# EasyEDA schematic 1-Schematic_miniCoffee.json

## Sheets
1 LEDs: TITLE: LEDs; REV: 1.0; Date: 2019-11-27; Sheet: 1/1; Drawn By: Jacopo Franco; Company: Addictivers.cc
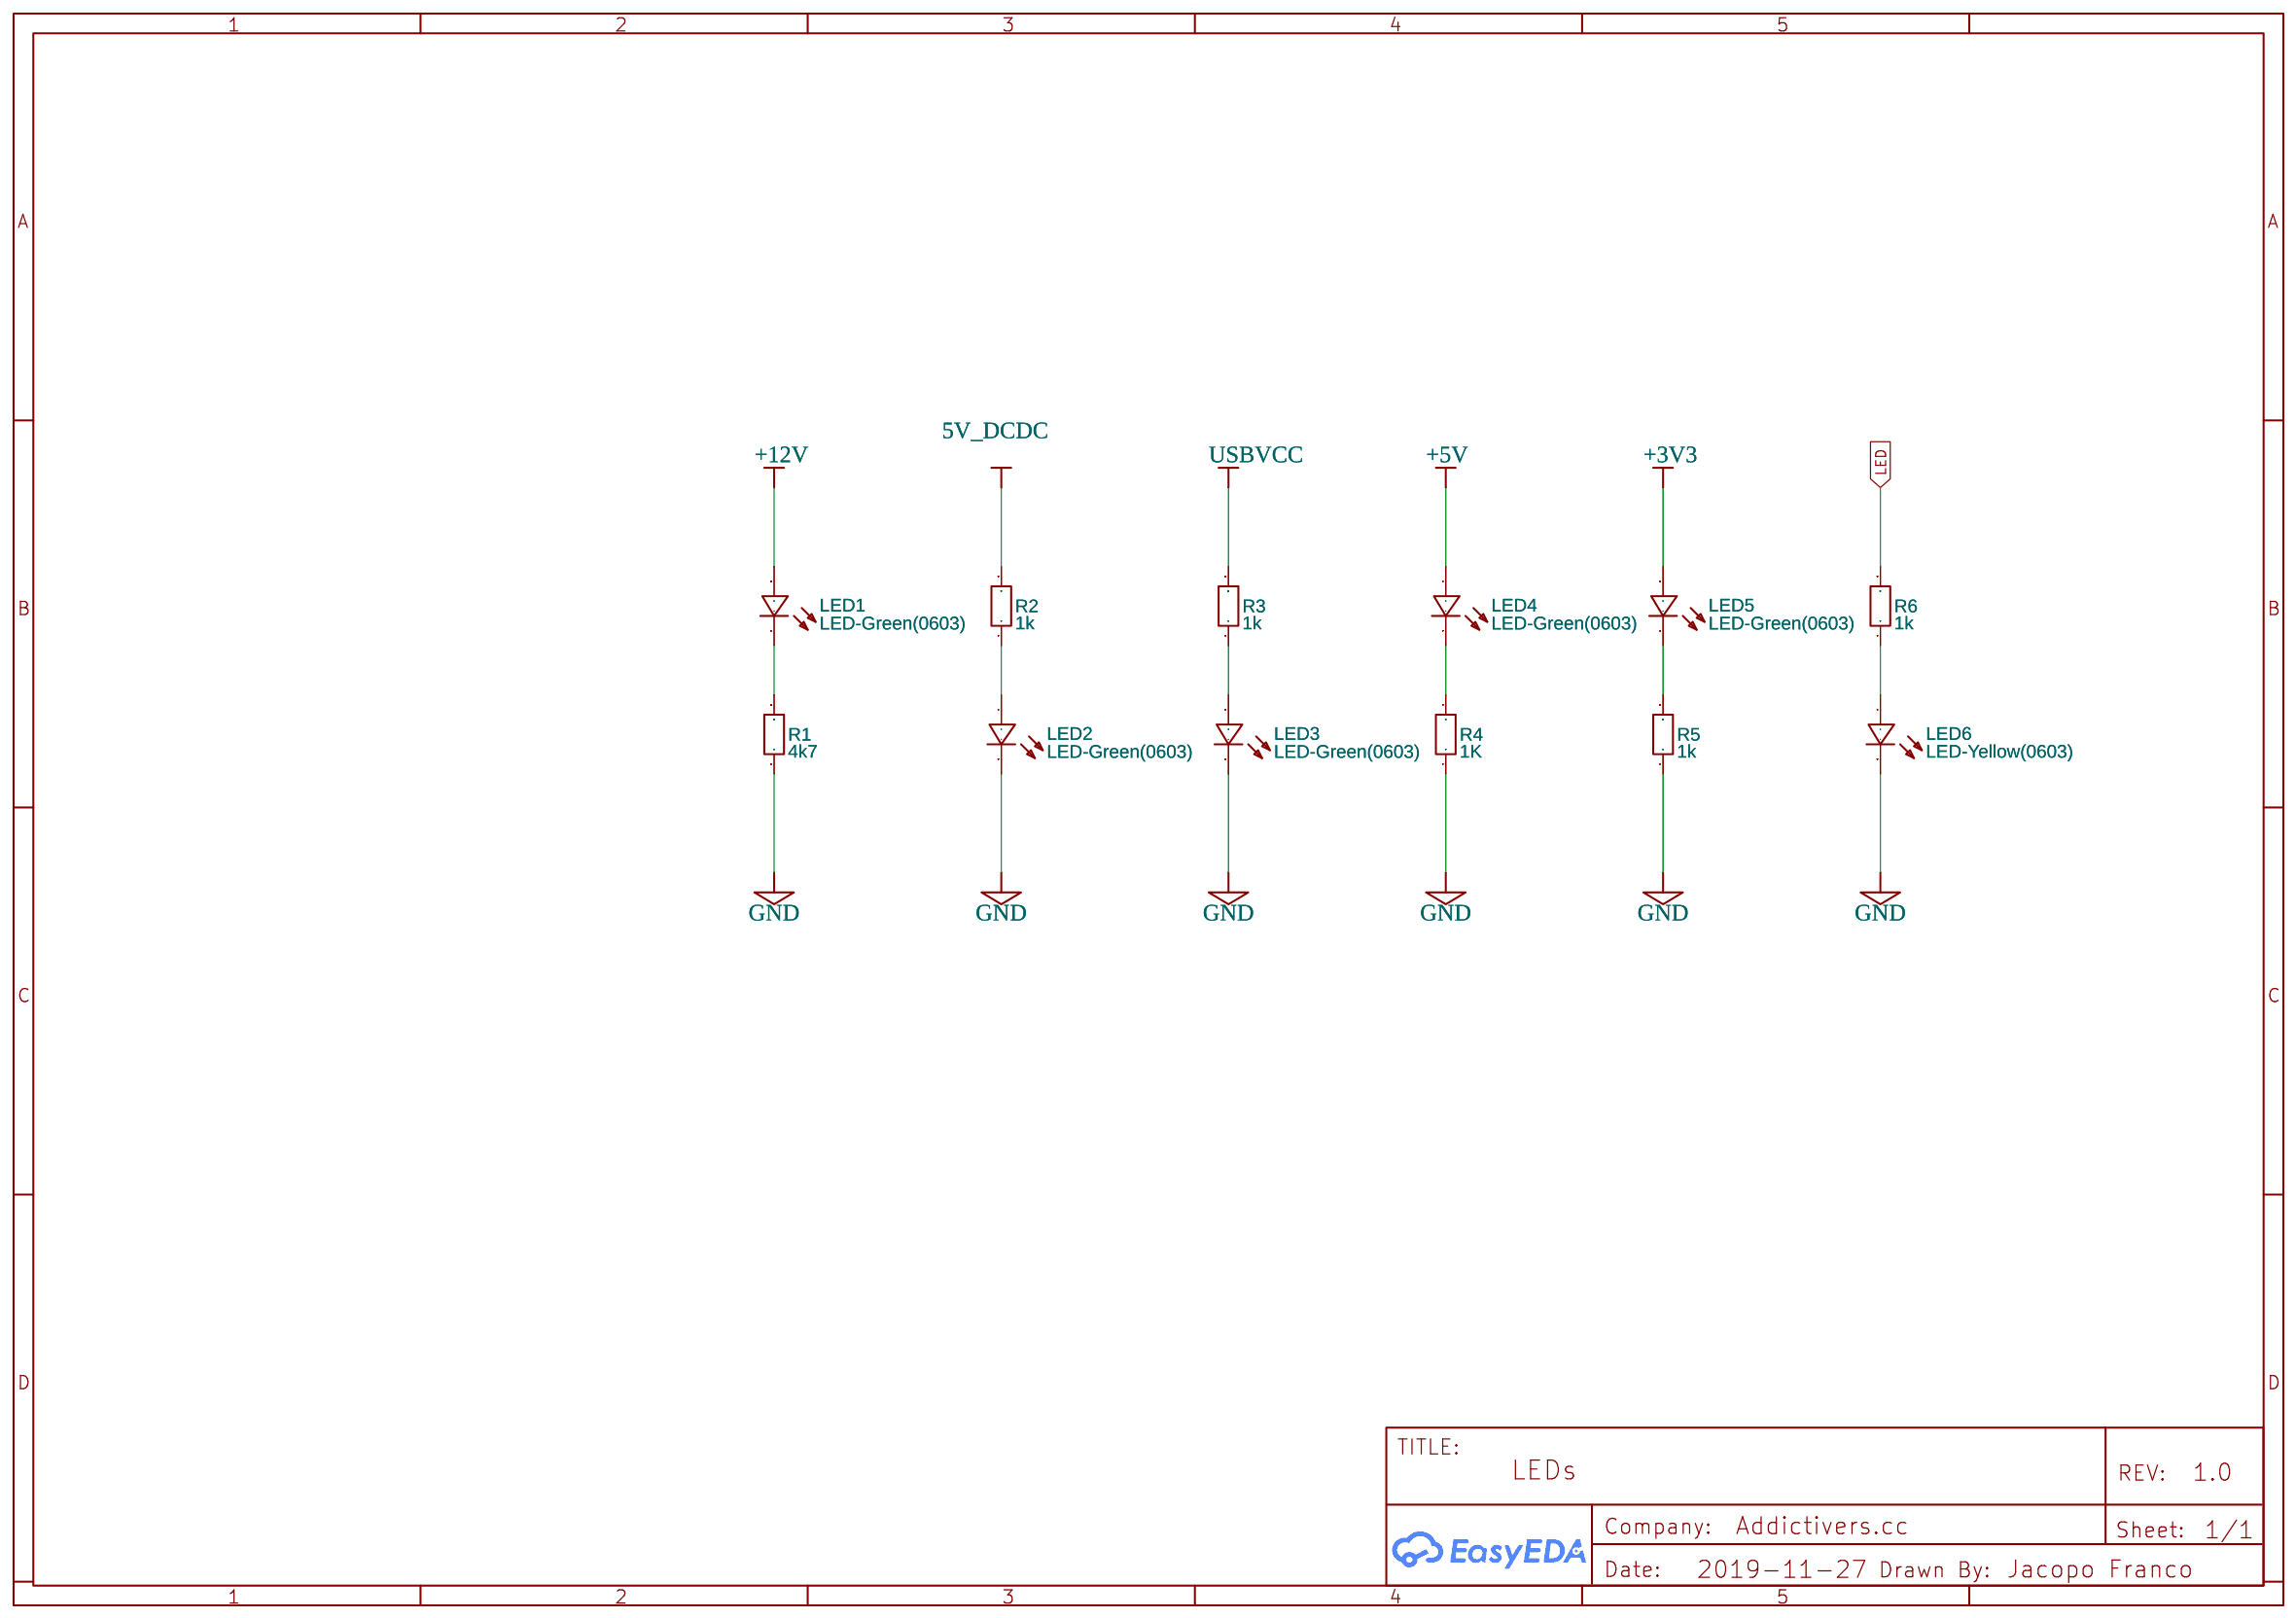
[diagram p0: LEDs]
2 Microcontroller: TITLE: Microcontroller
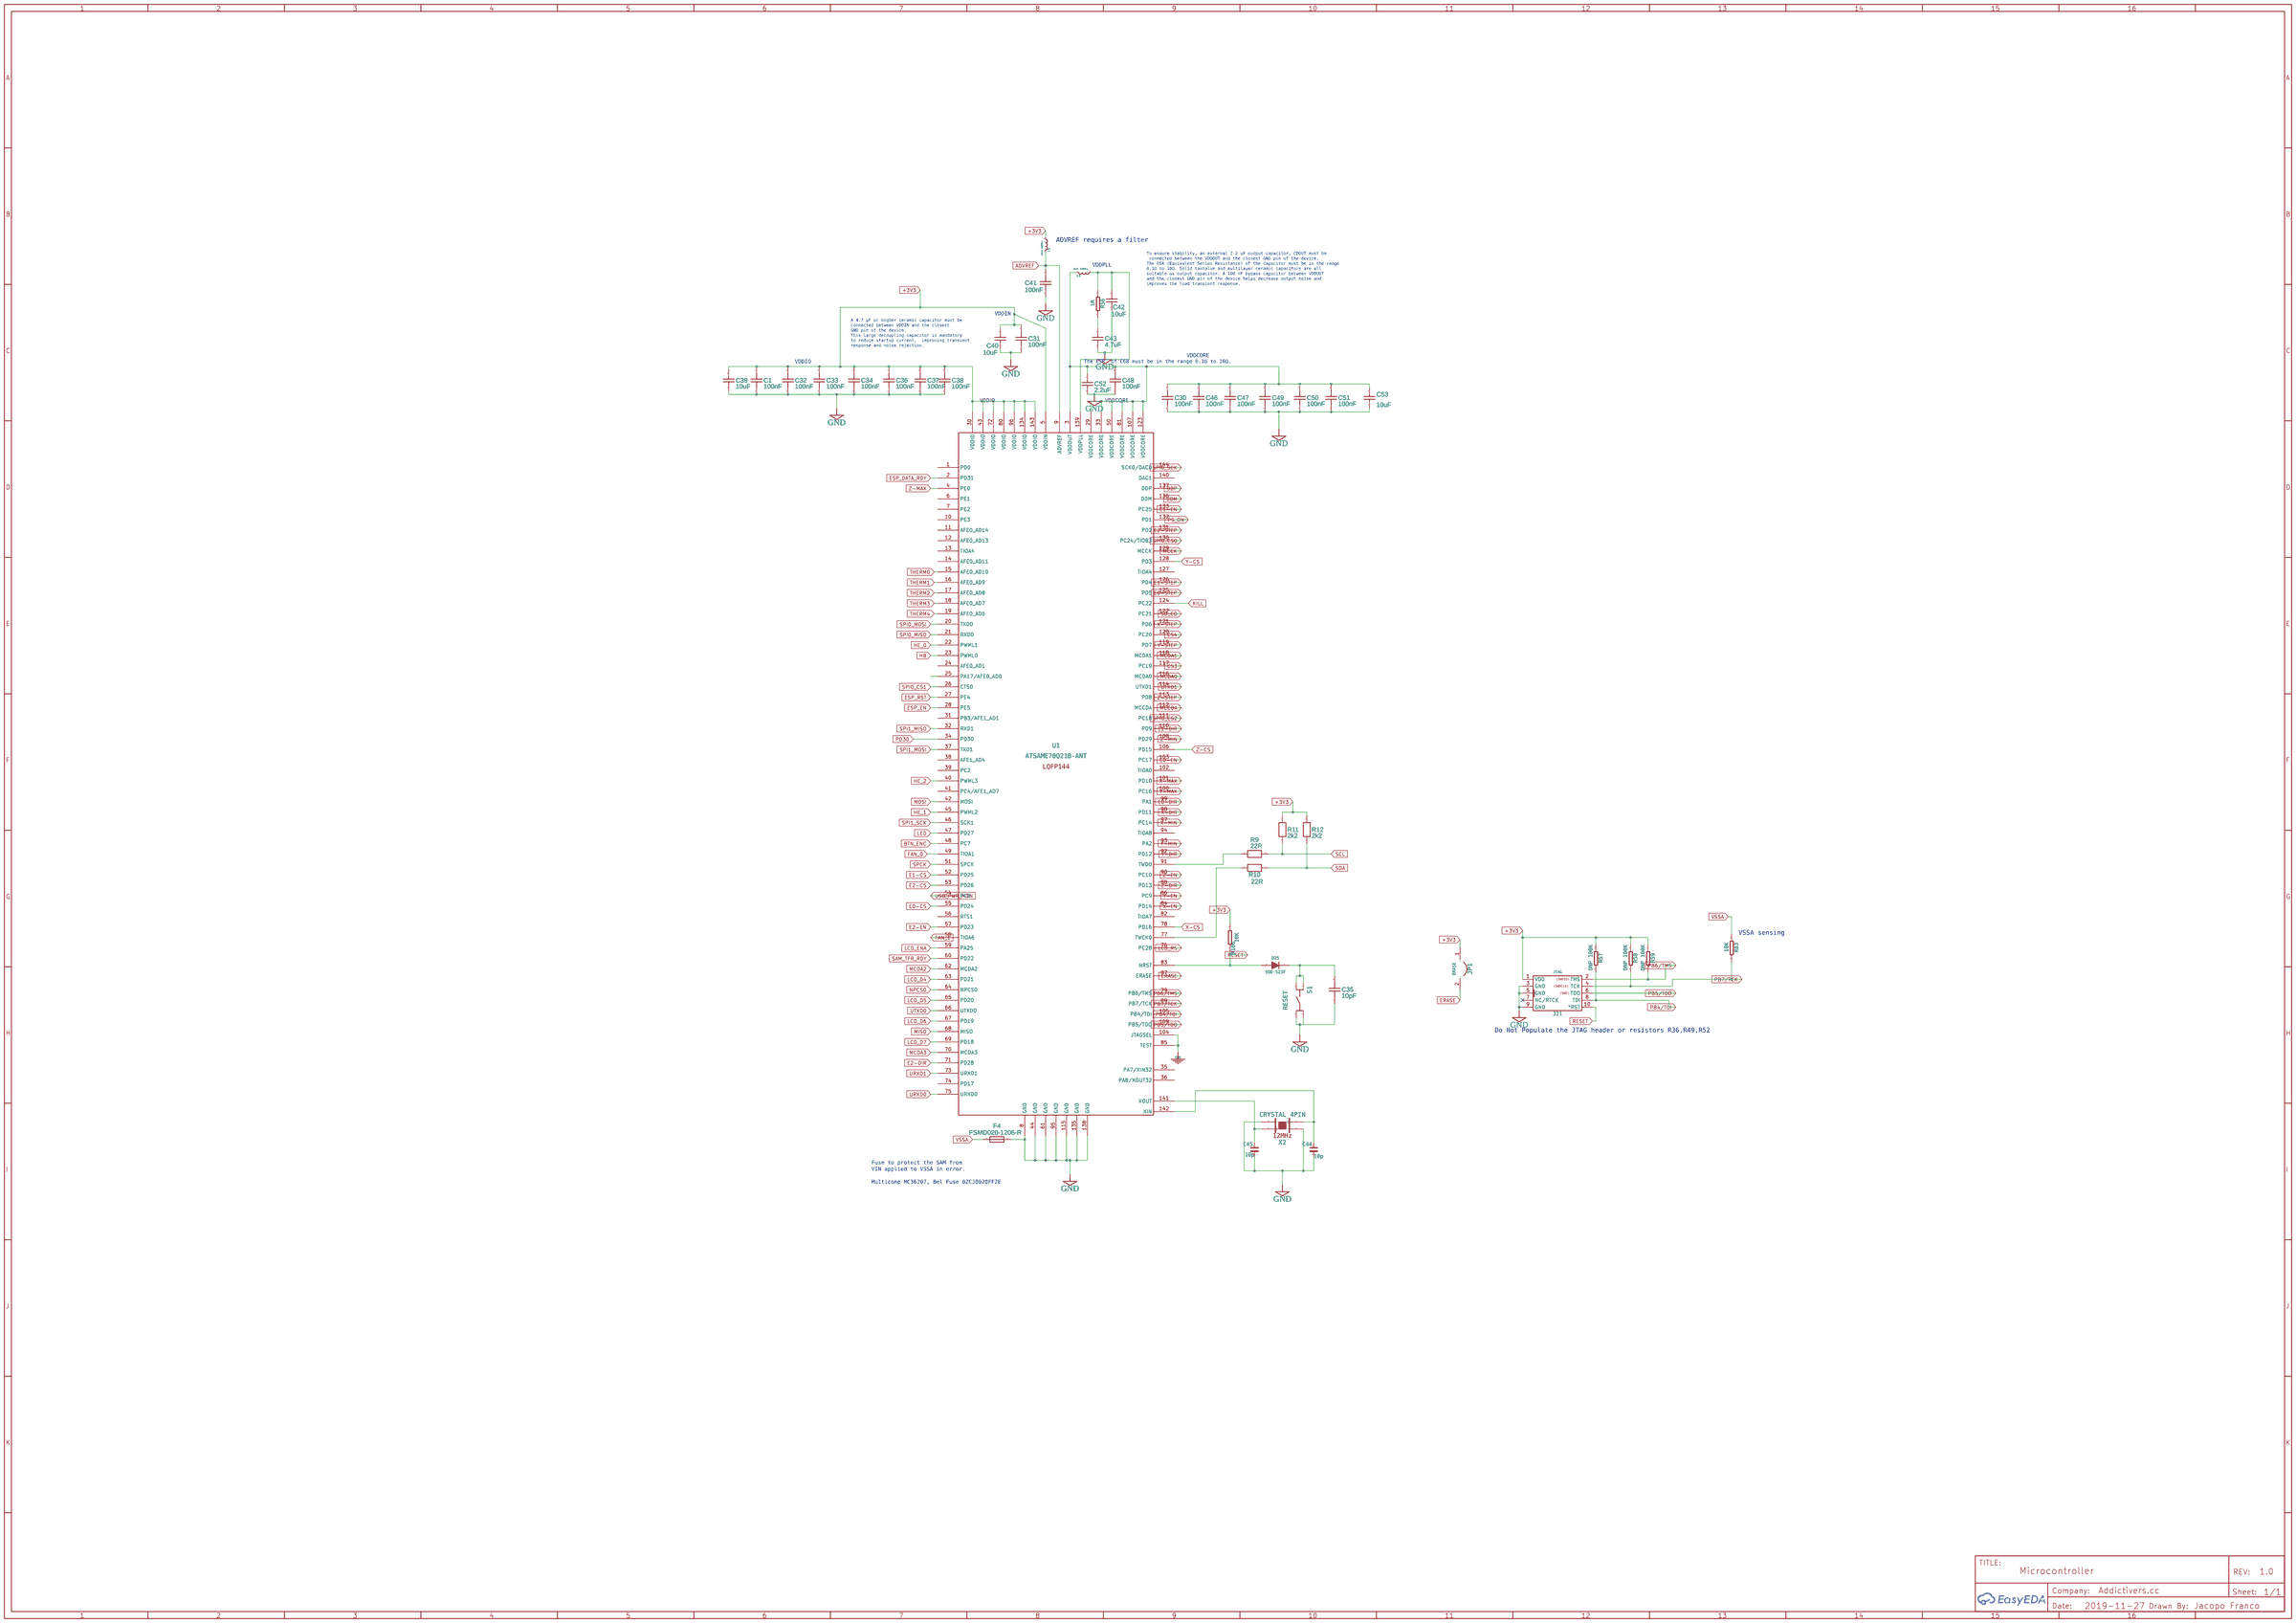
[diagram p1: Microcontroller]
3 Auxiliary IO: TITLE: Auxiliary I/O; Date: 2019-12-01
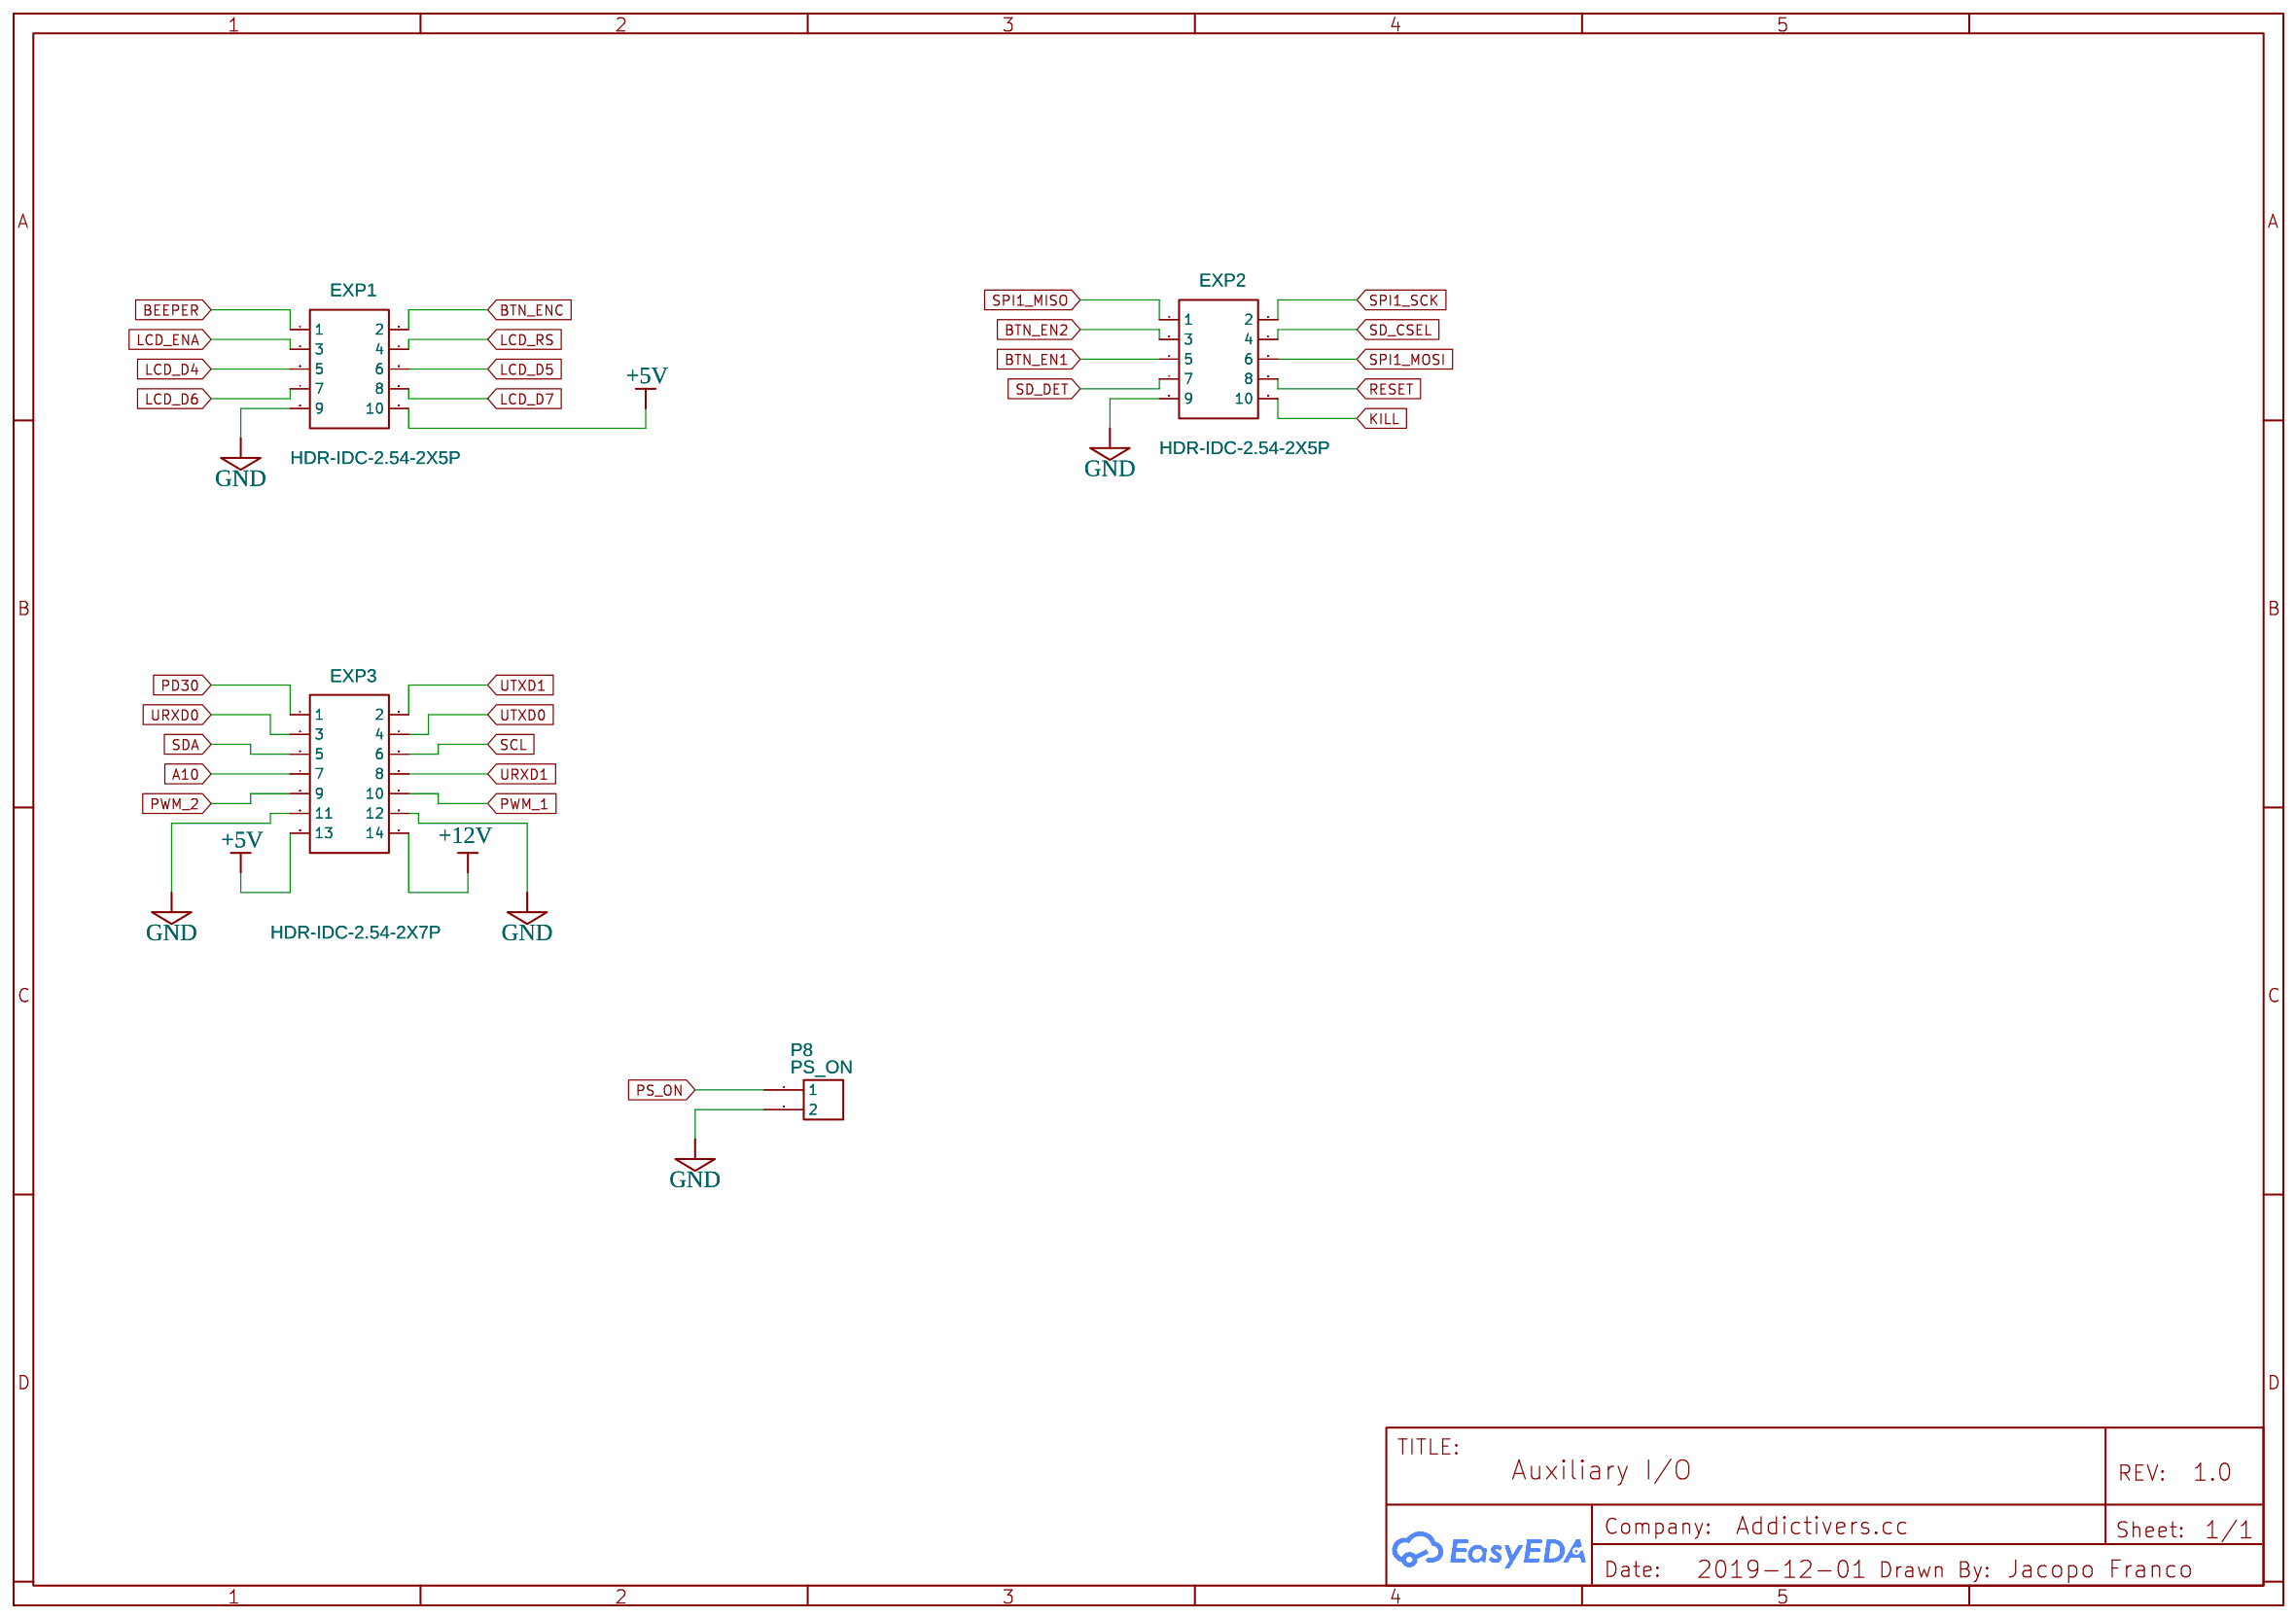
[diagram p2: Auxiliary IO]
4 I2C Headers: TITLE: I2C Headers; Date: 2019-12-01
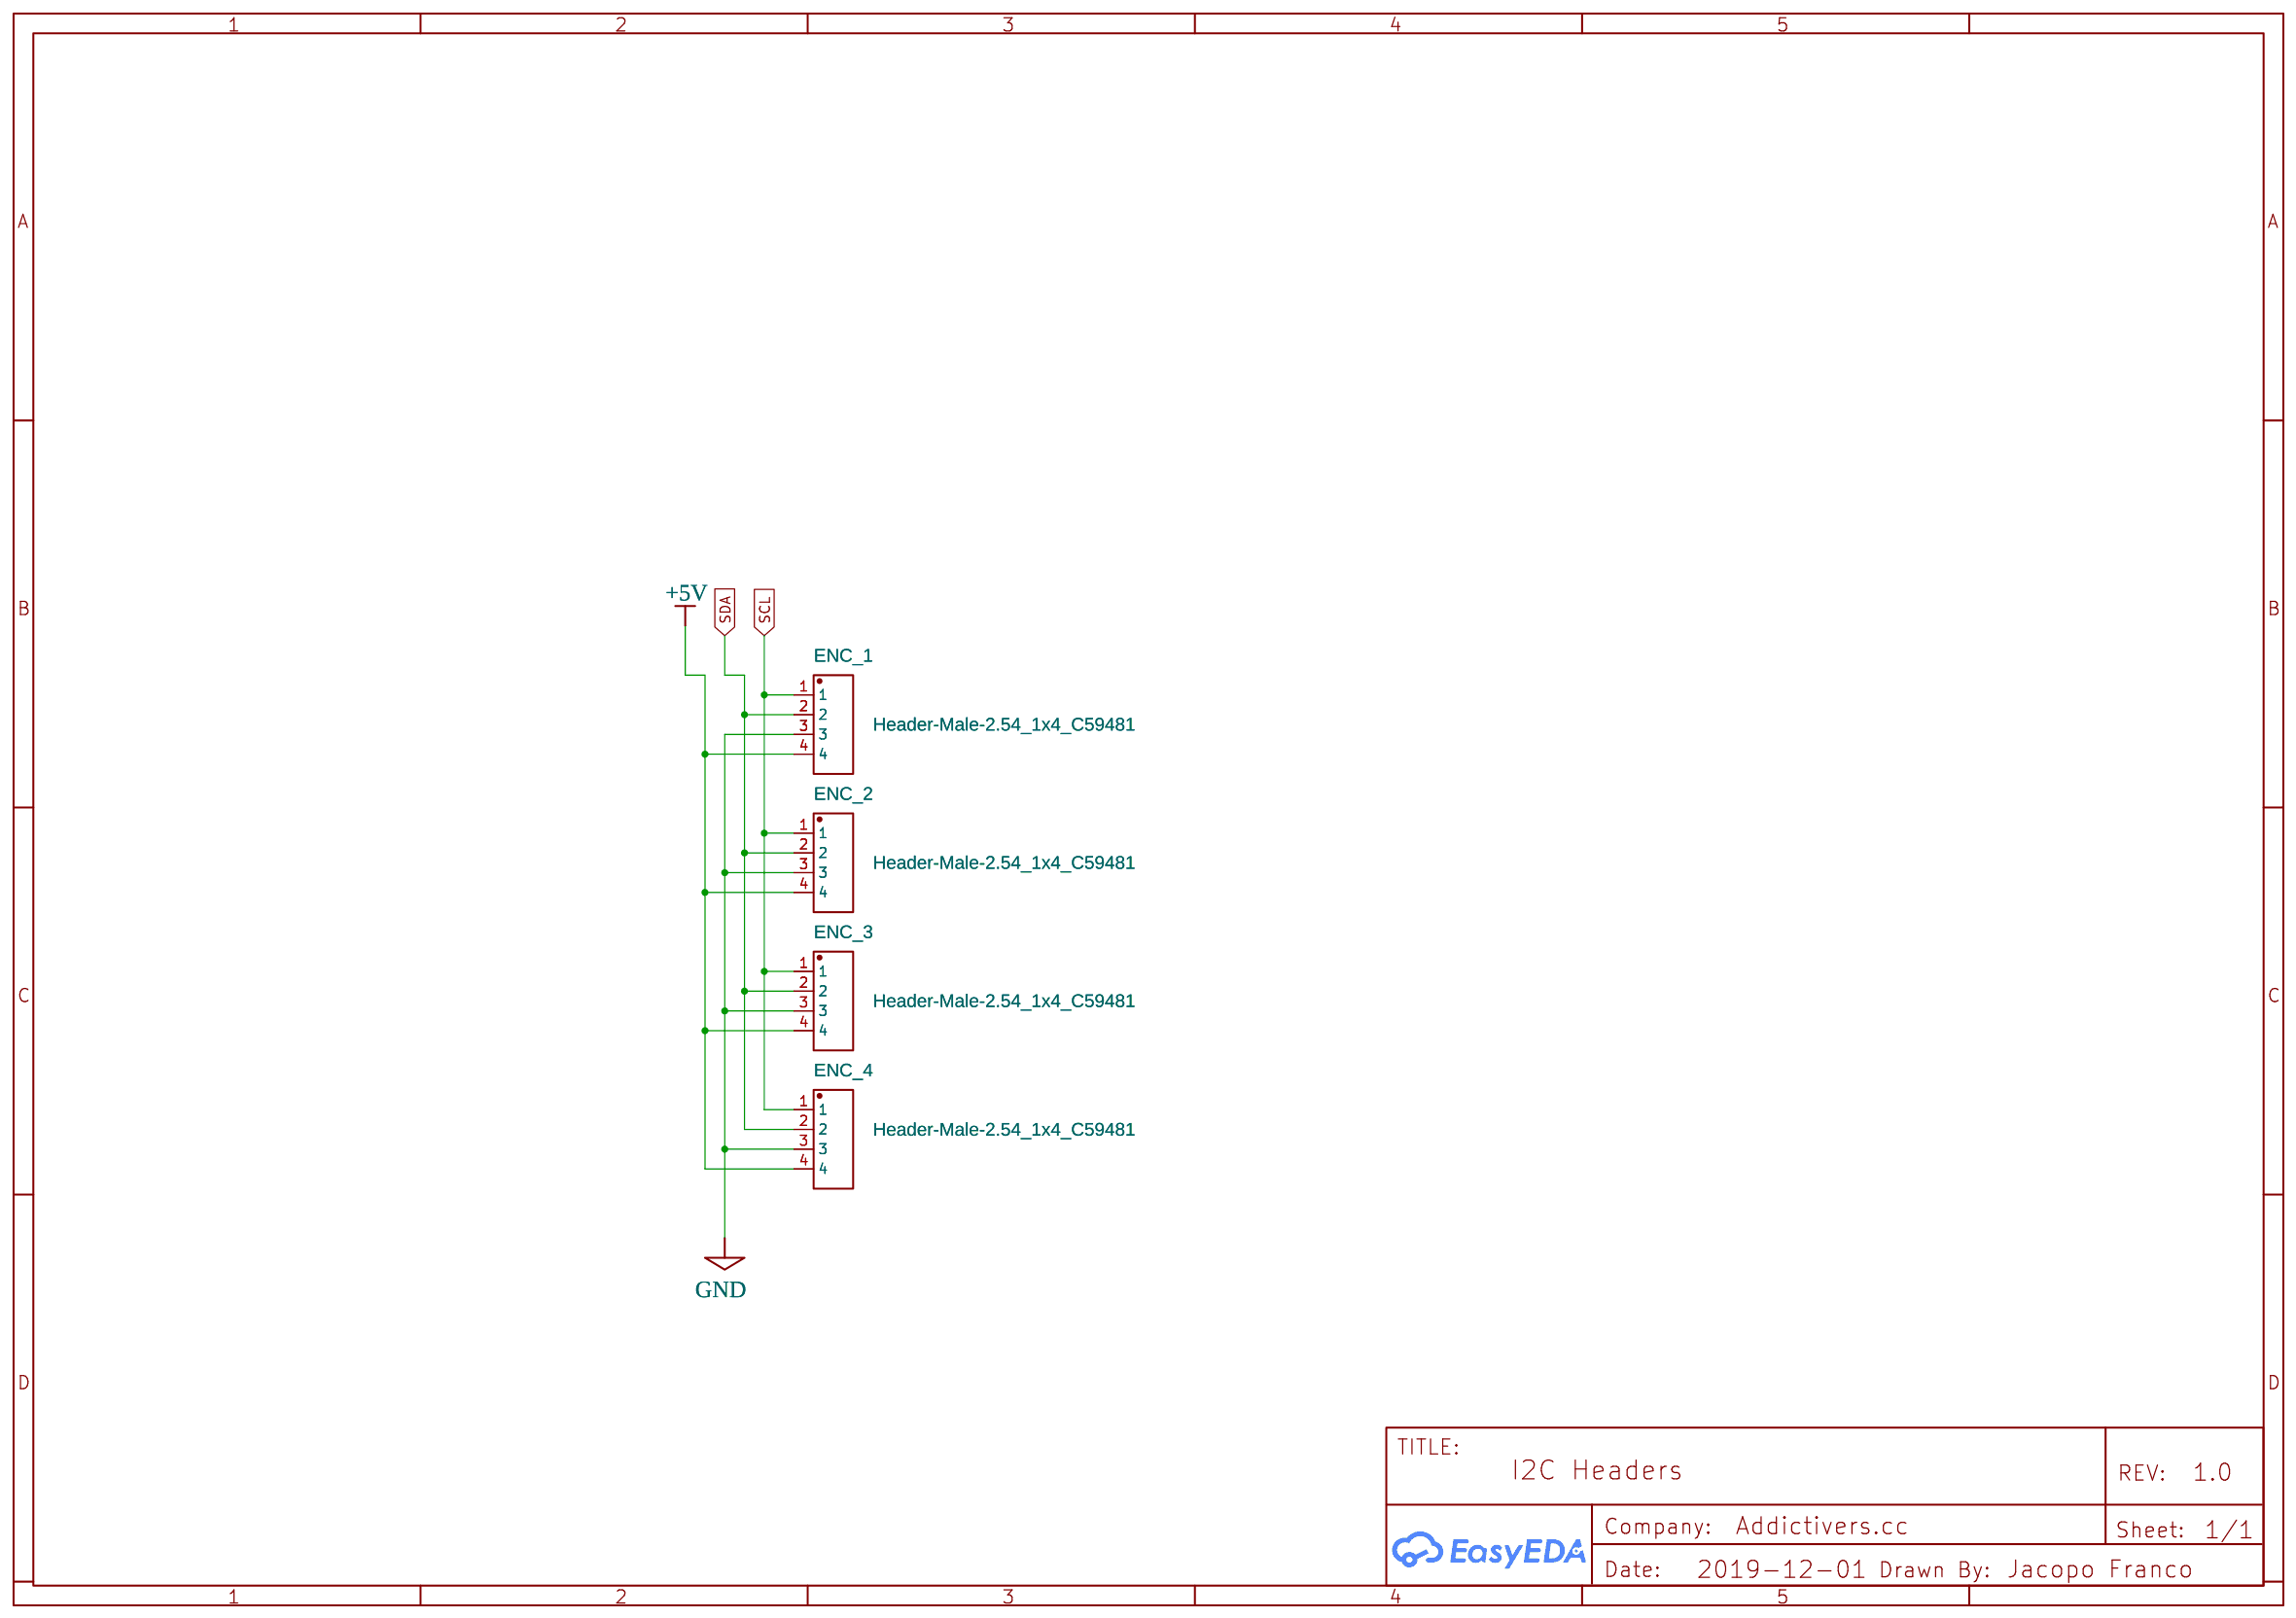
[diagram p3: I2C Headers]
5 Endstops: TITLE: Endstops; Date: 2019-12-01
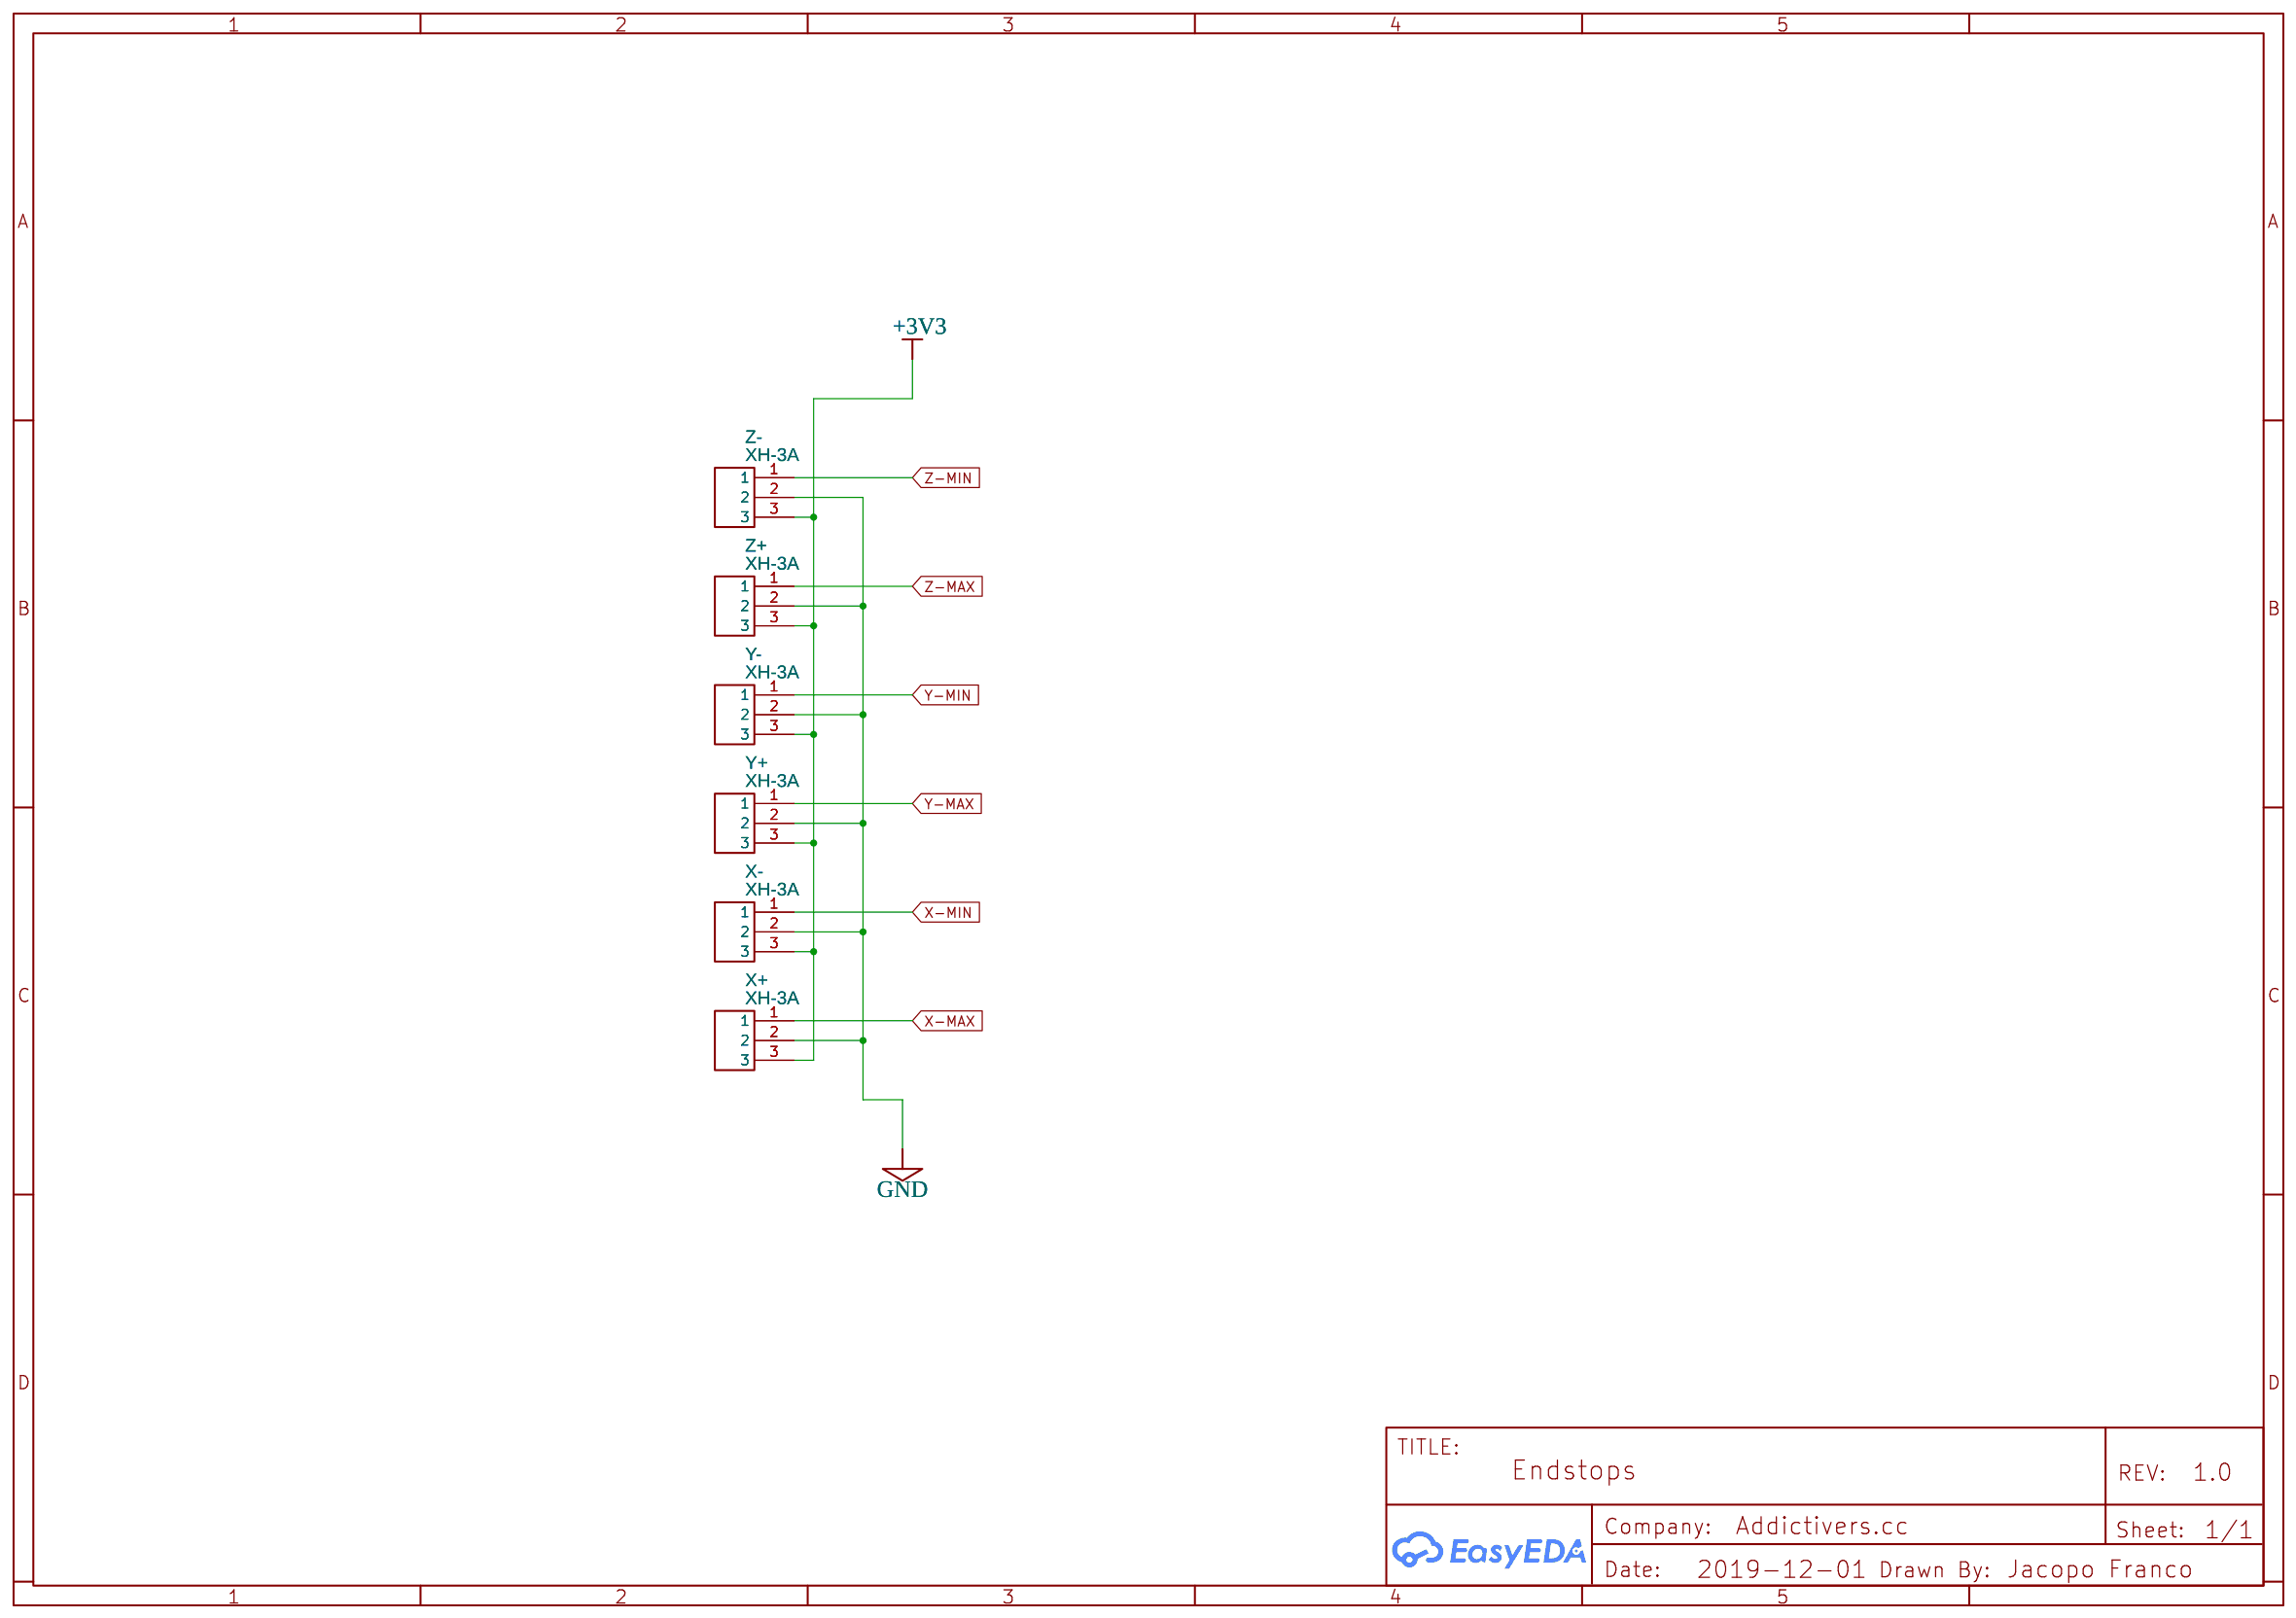
[diagram p4: Endstops]
6 Hotends: TITLE: Hotends; Date: 2019-12-01
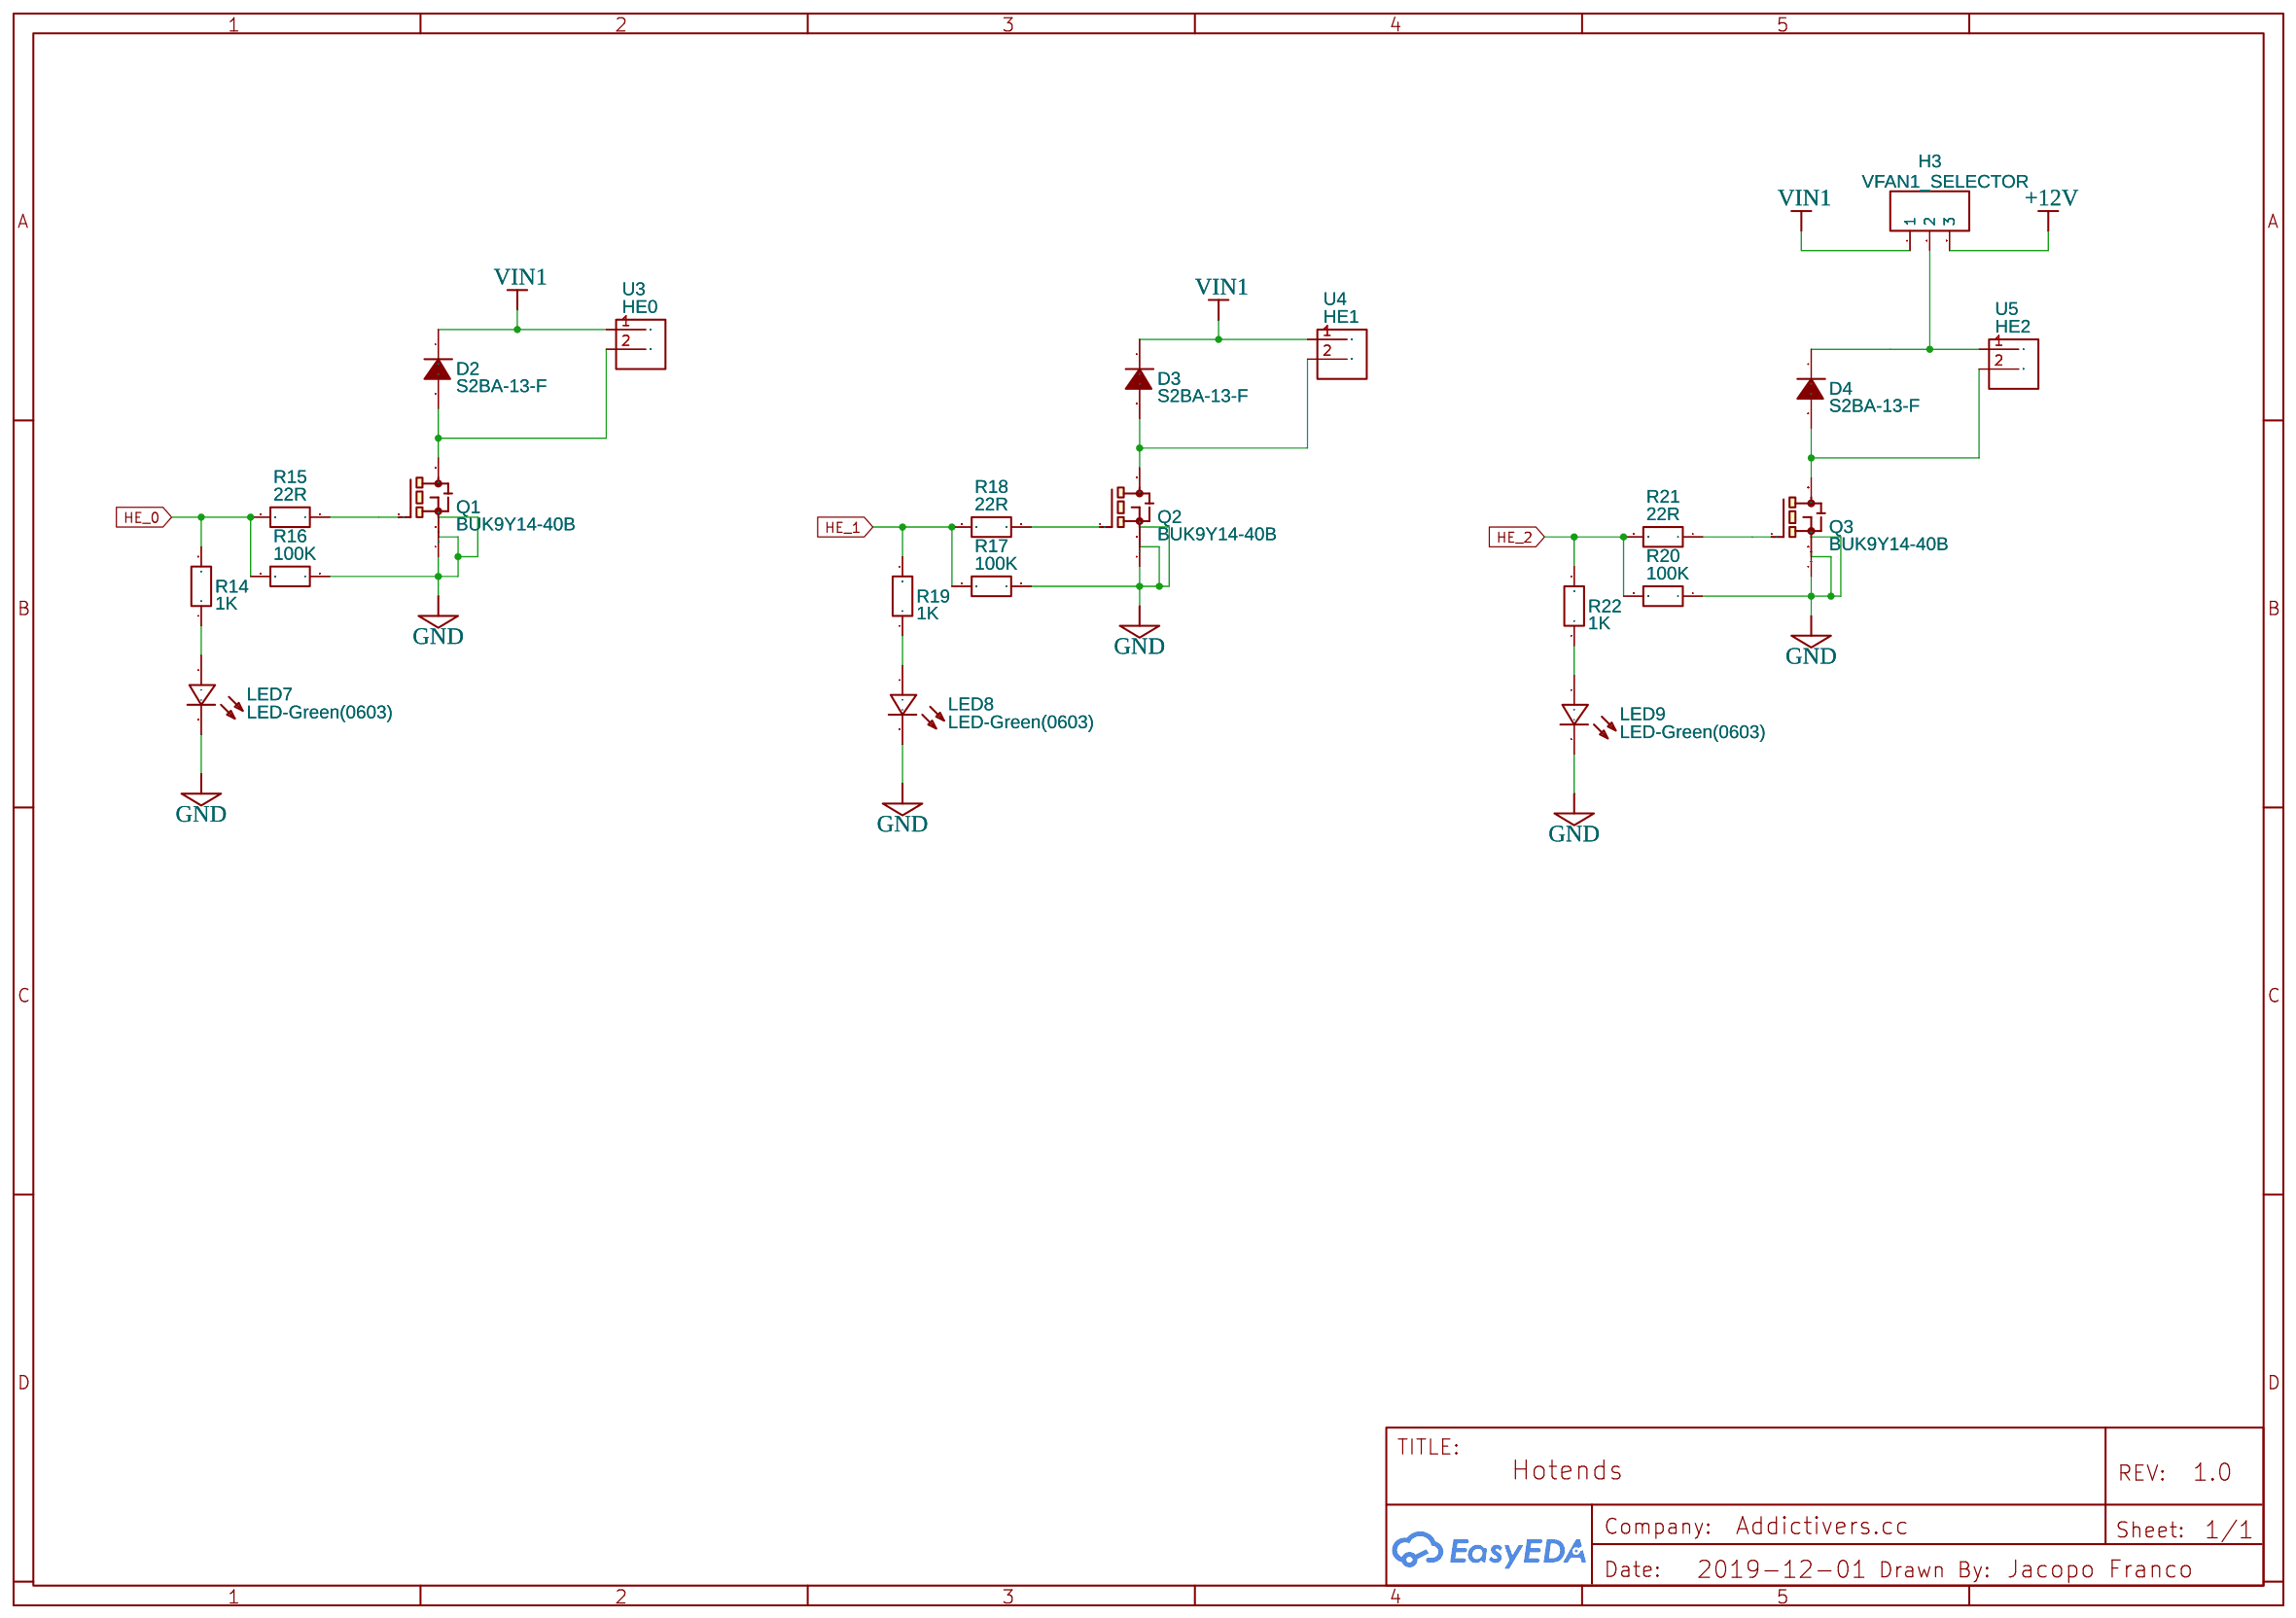
[diagram p5: Hotends]
7 Thermistors: TITLE: Thermistors; Date: 2019-12-01
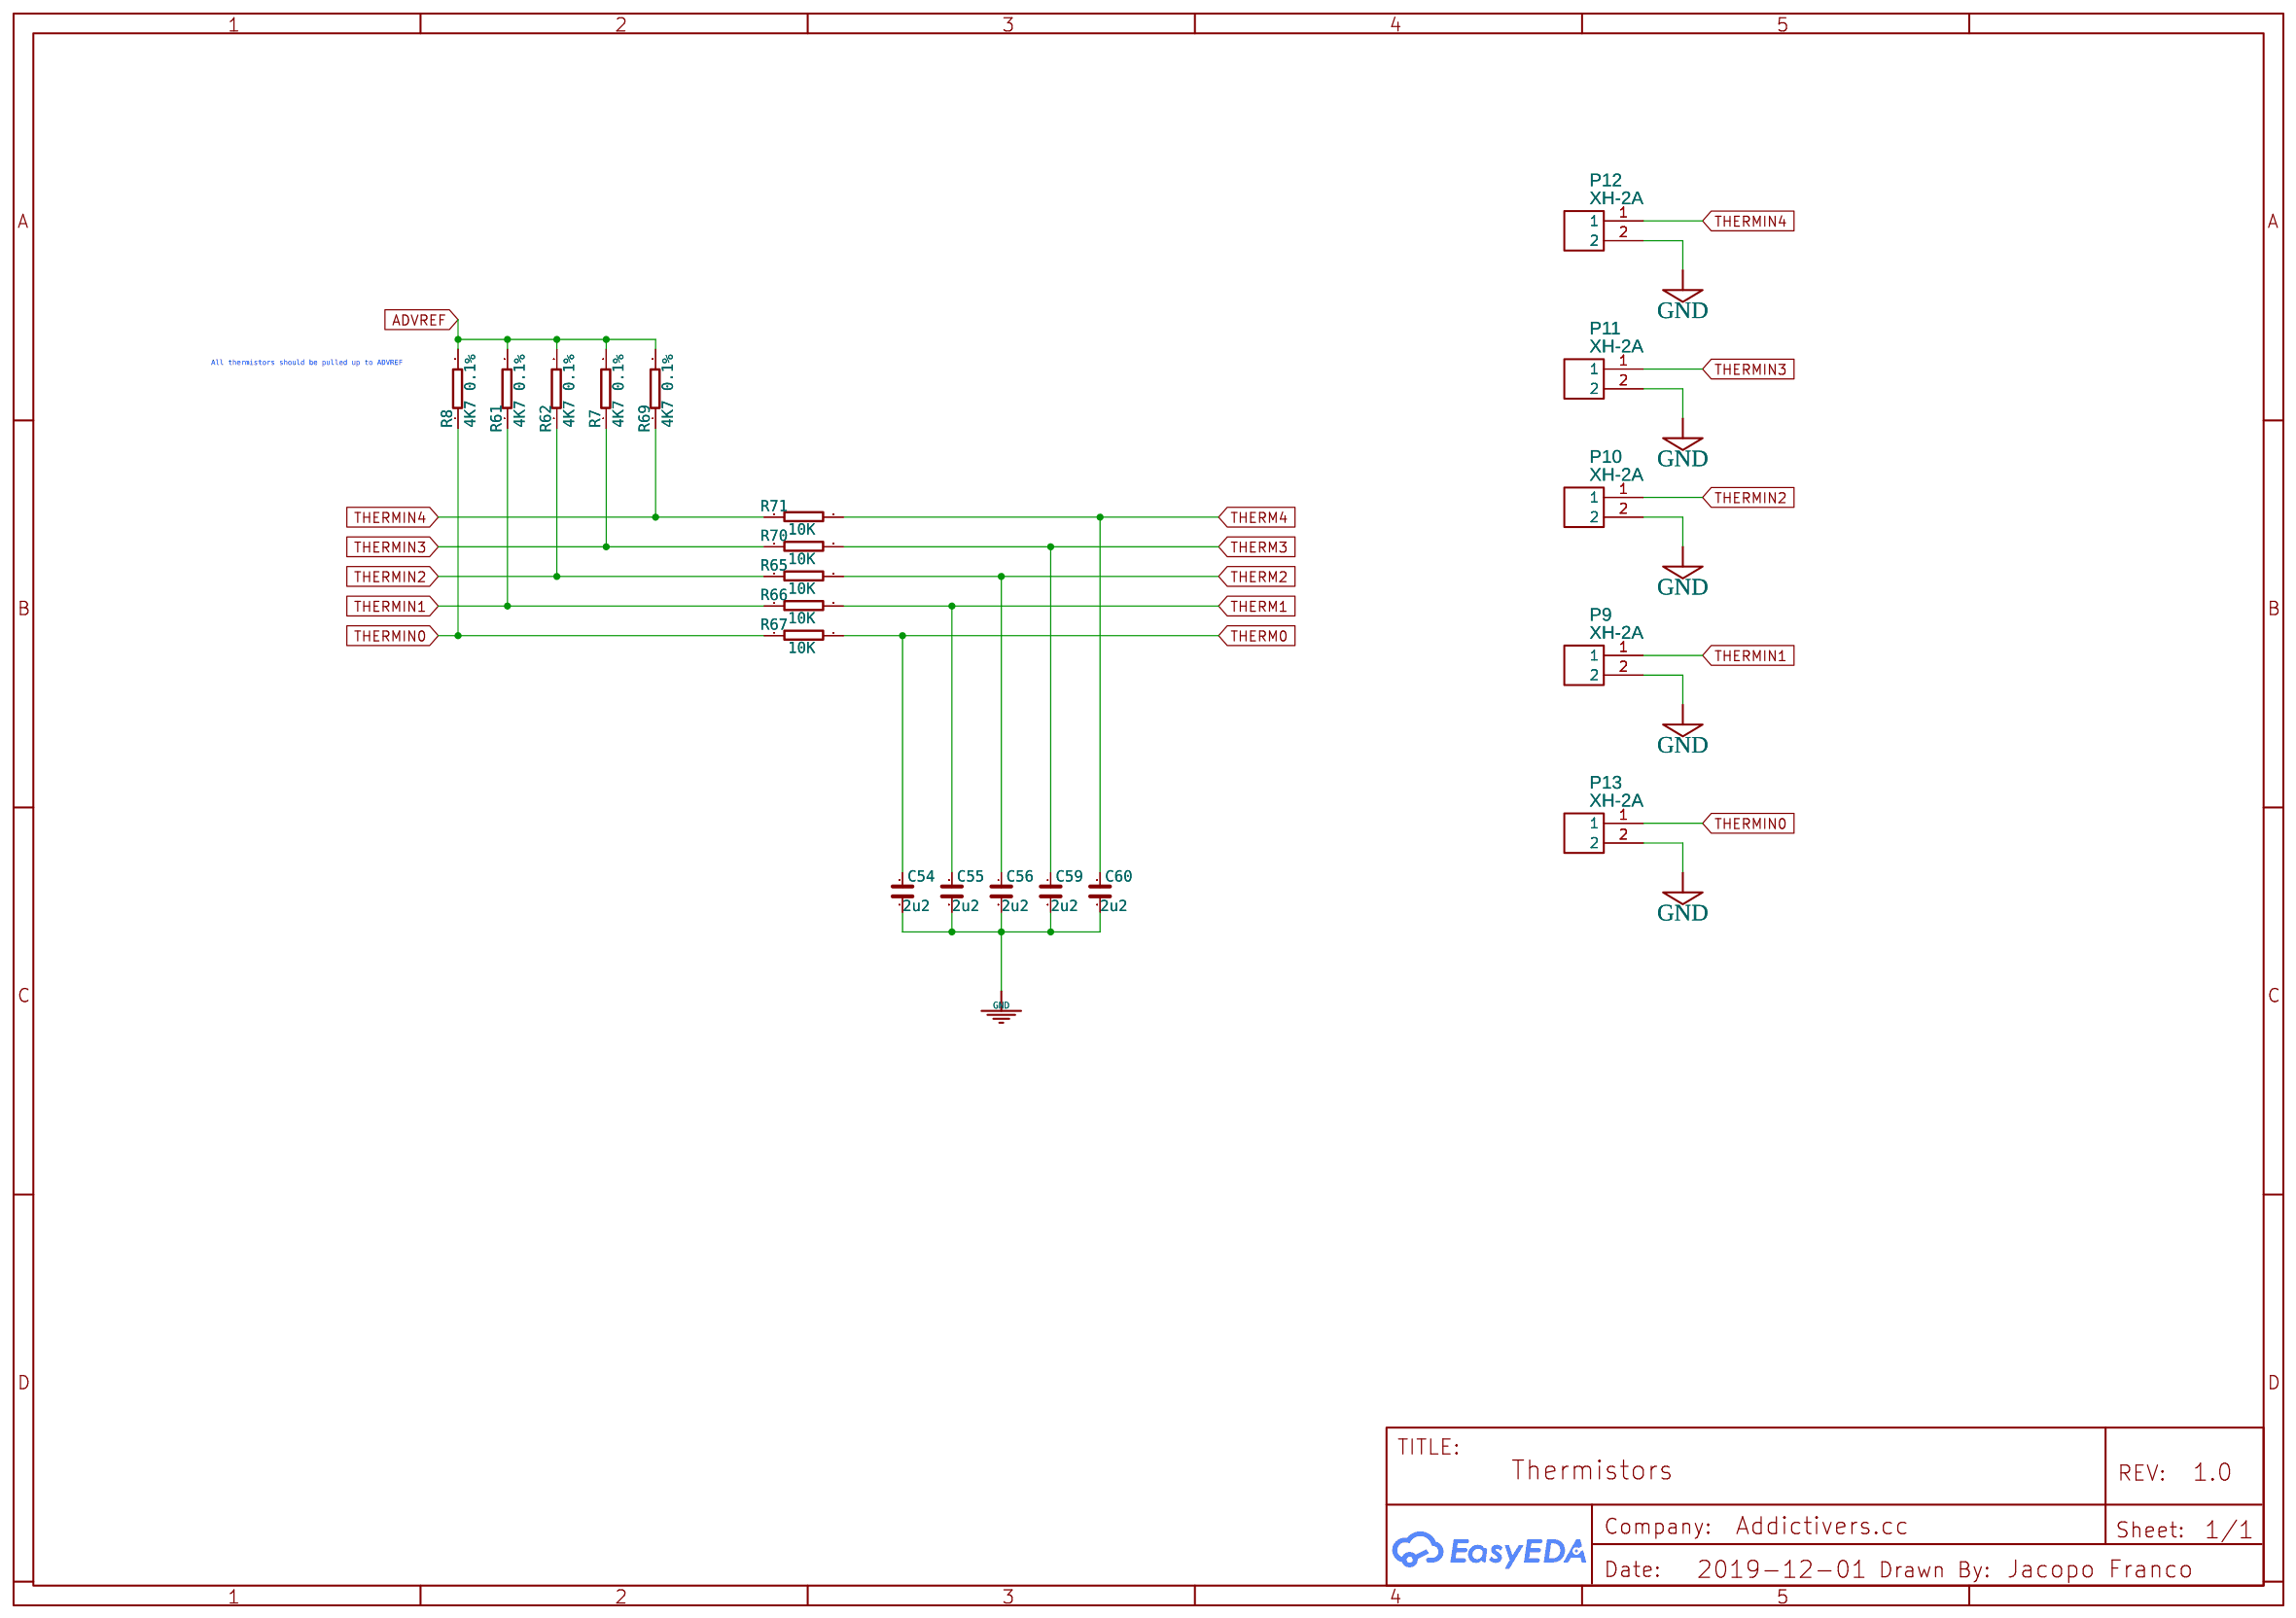
[diagram p6: Thermistors]
8 EEPROM: TITLE: EEPROM; Date: 2019-12-01
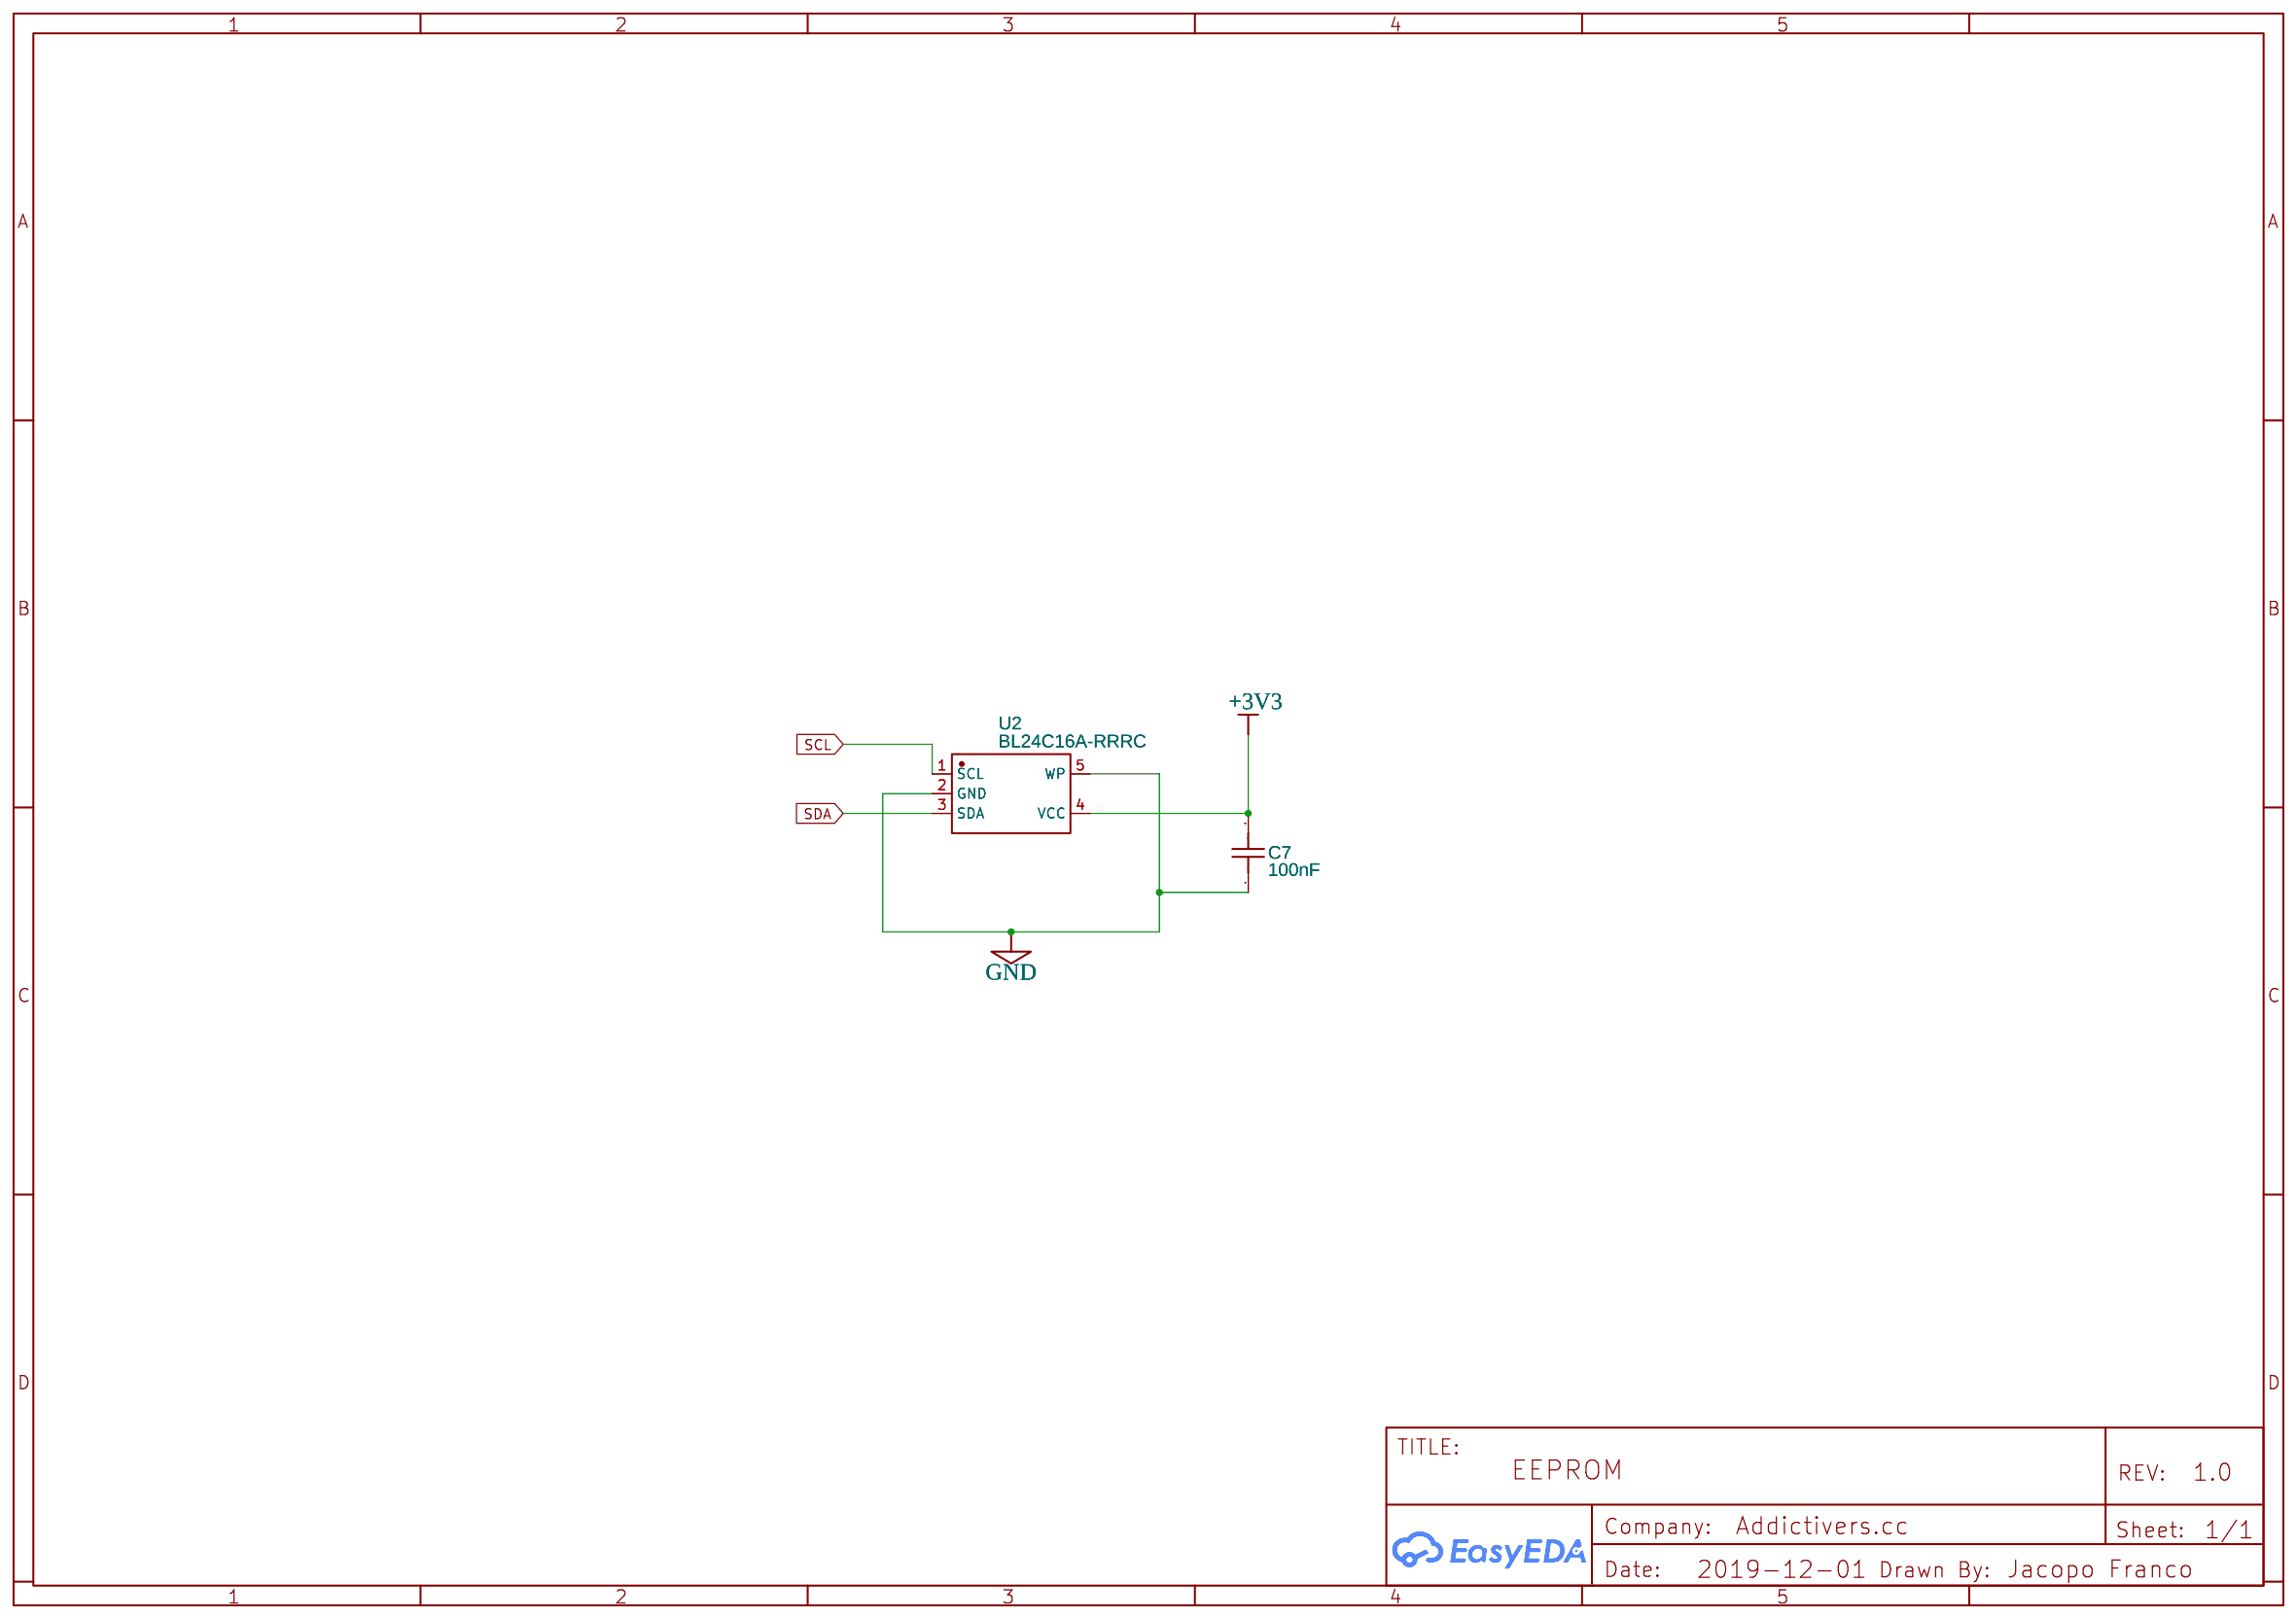
[diagram p7: EEPROM]
9 Heated Bed: TITLE: Heated Bed; Date: 2019-12-02
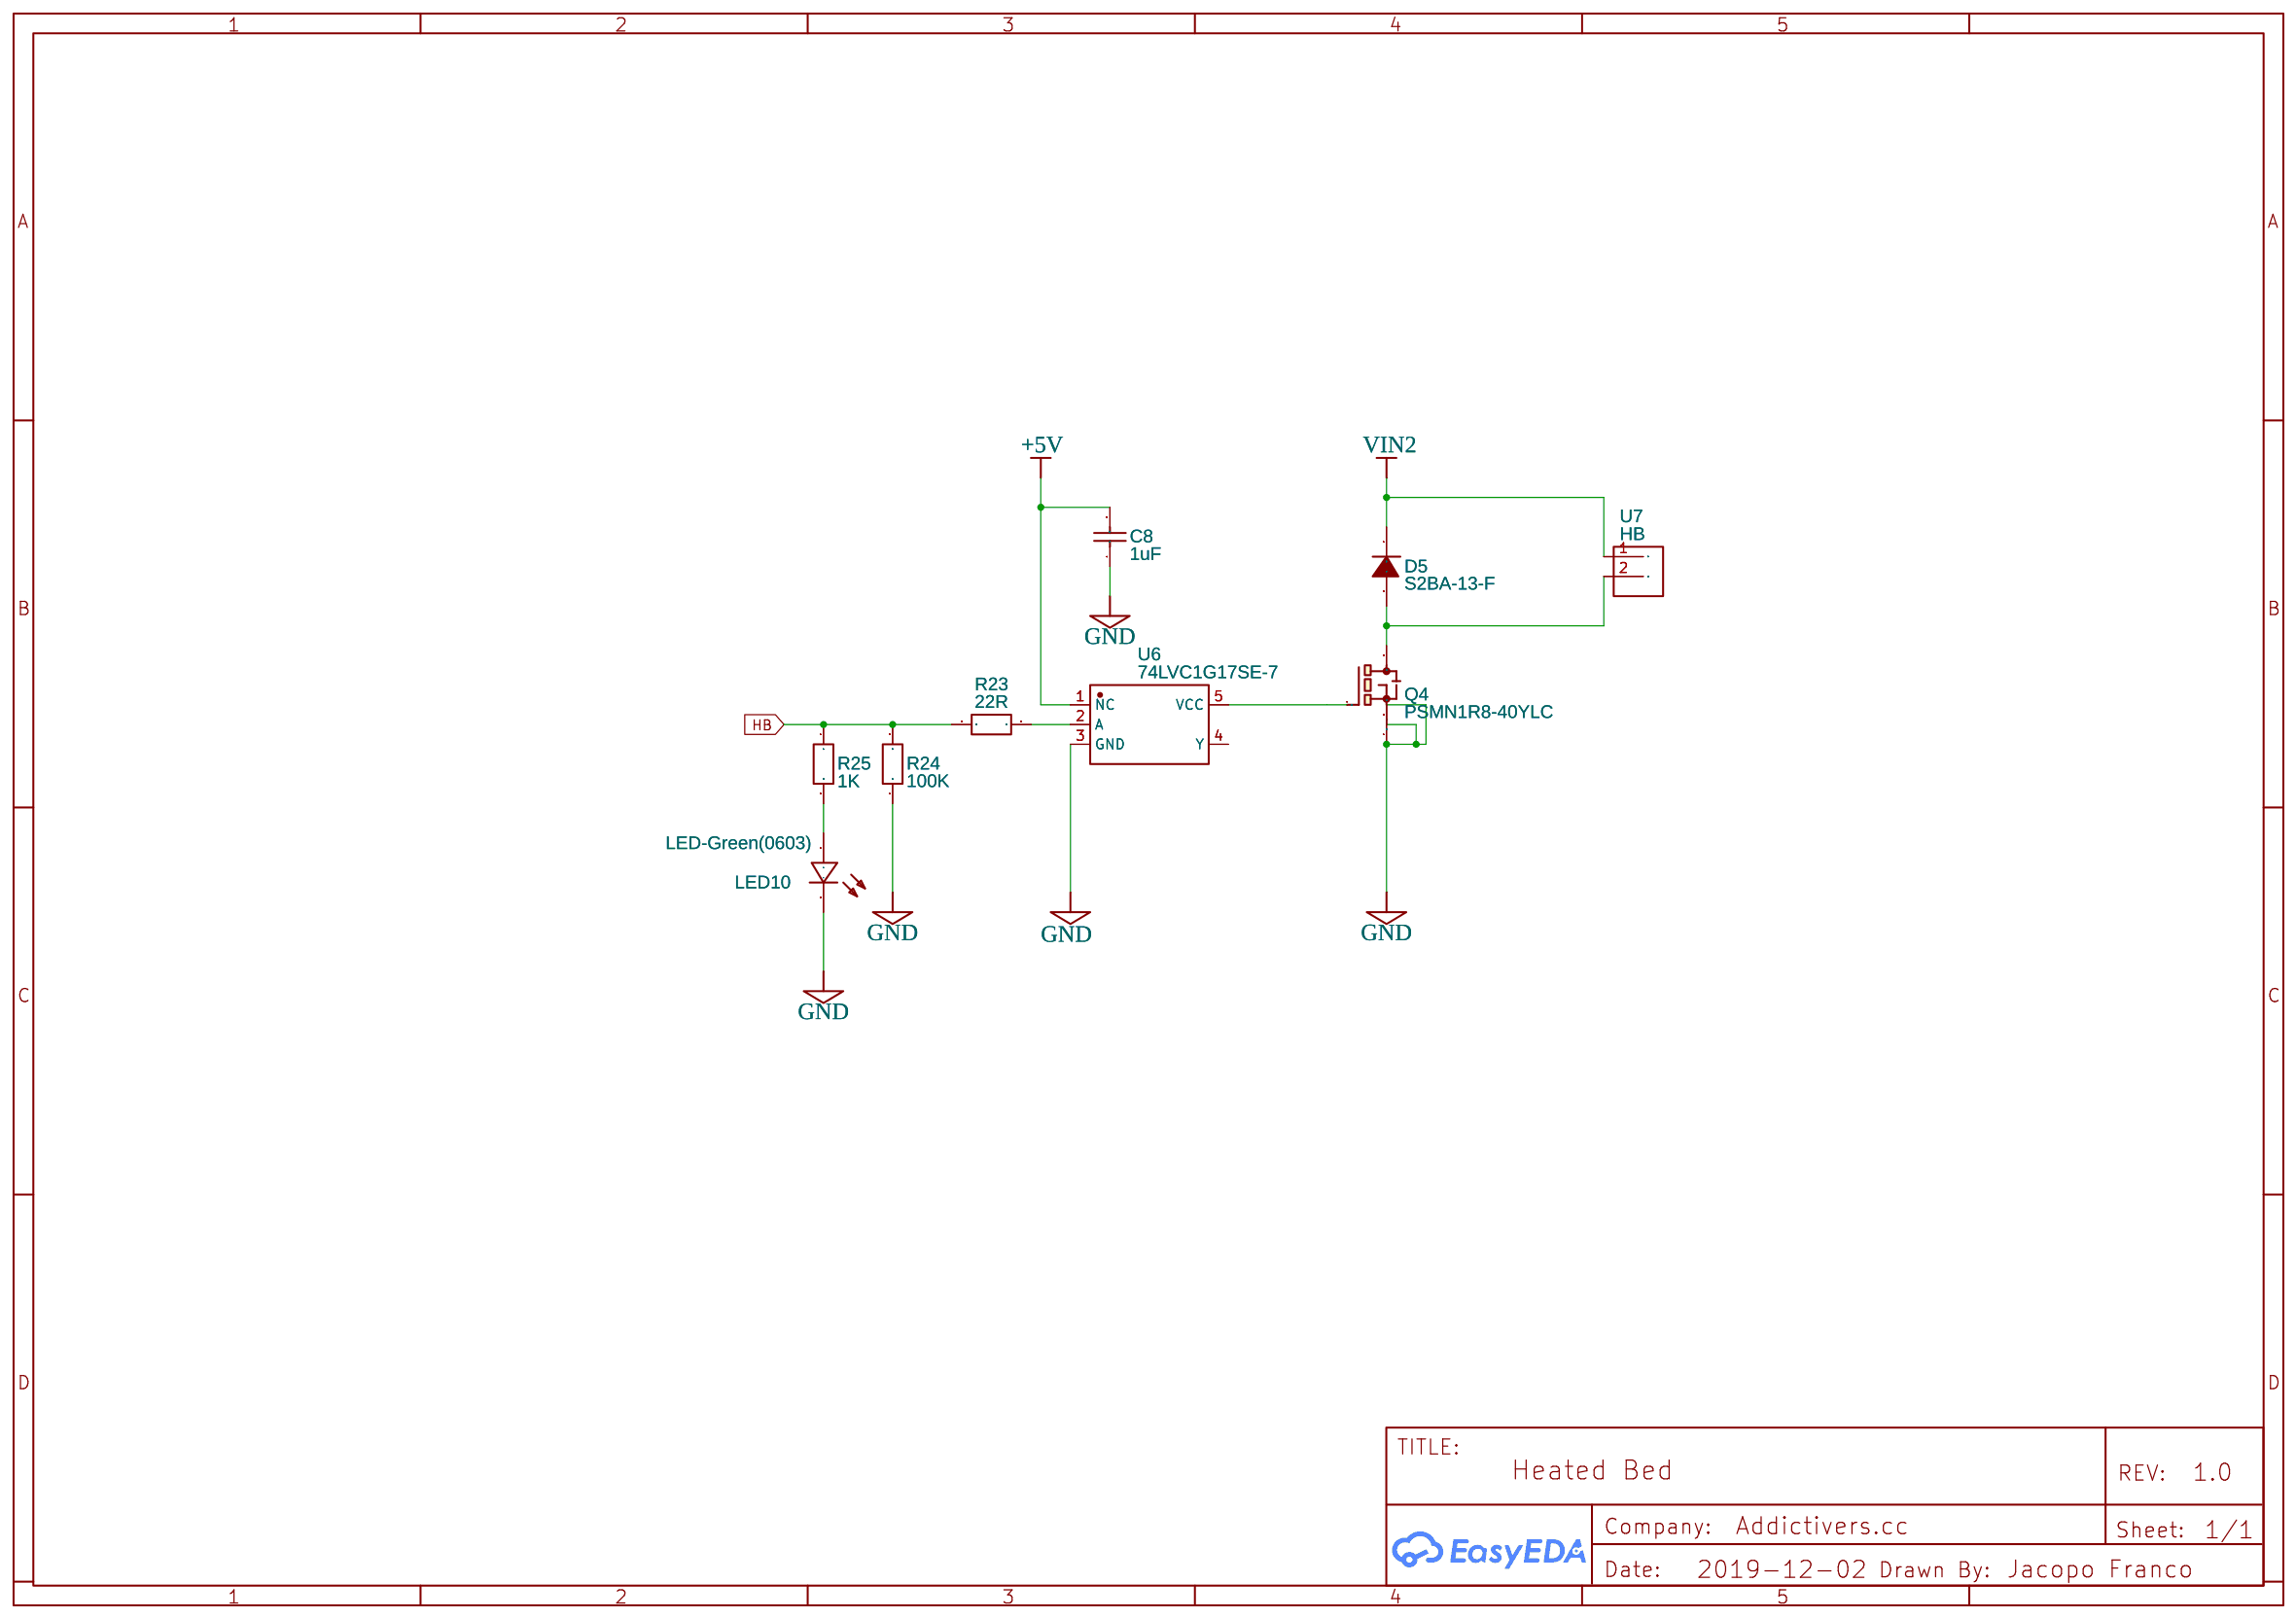
[diagram p8: Heated Bed]
10 Fans: TITLE: Fans; Date: 2019-12-02
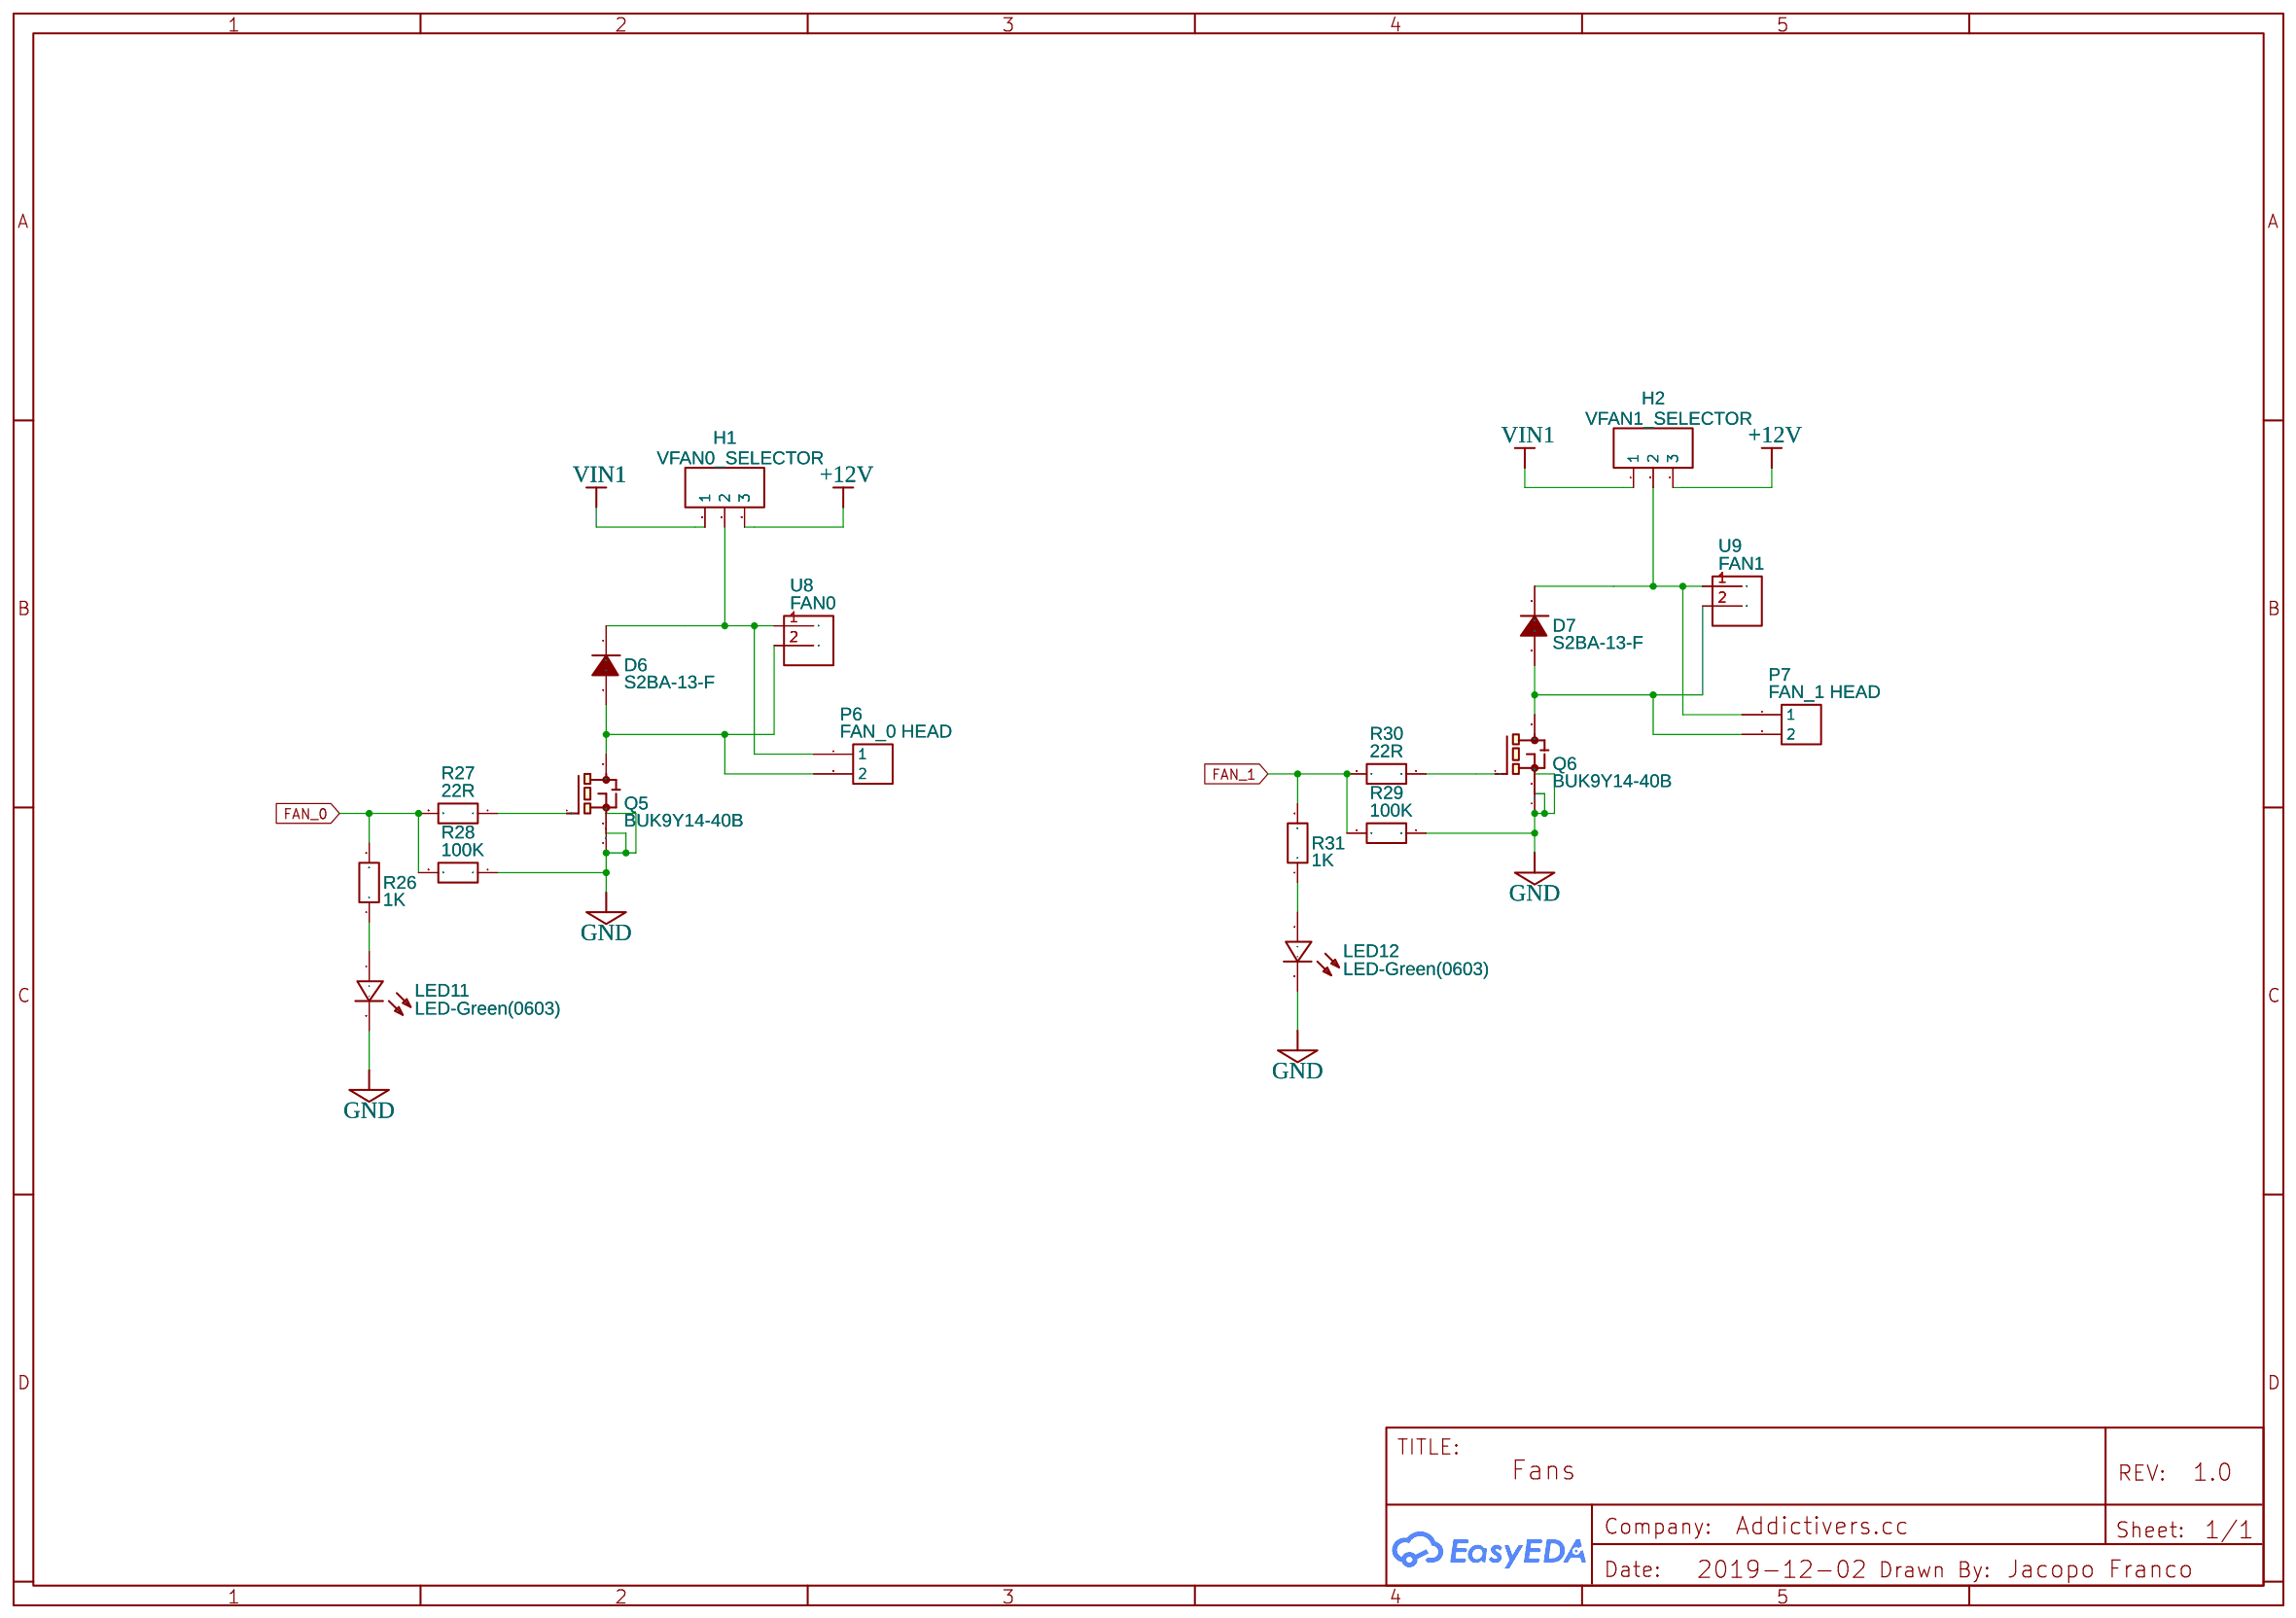
[diagram p9: Fans]
11 Power: TITLE: Power; Date: 2019-12-02
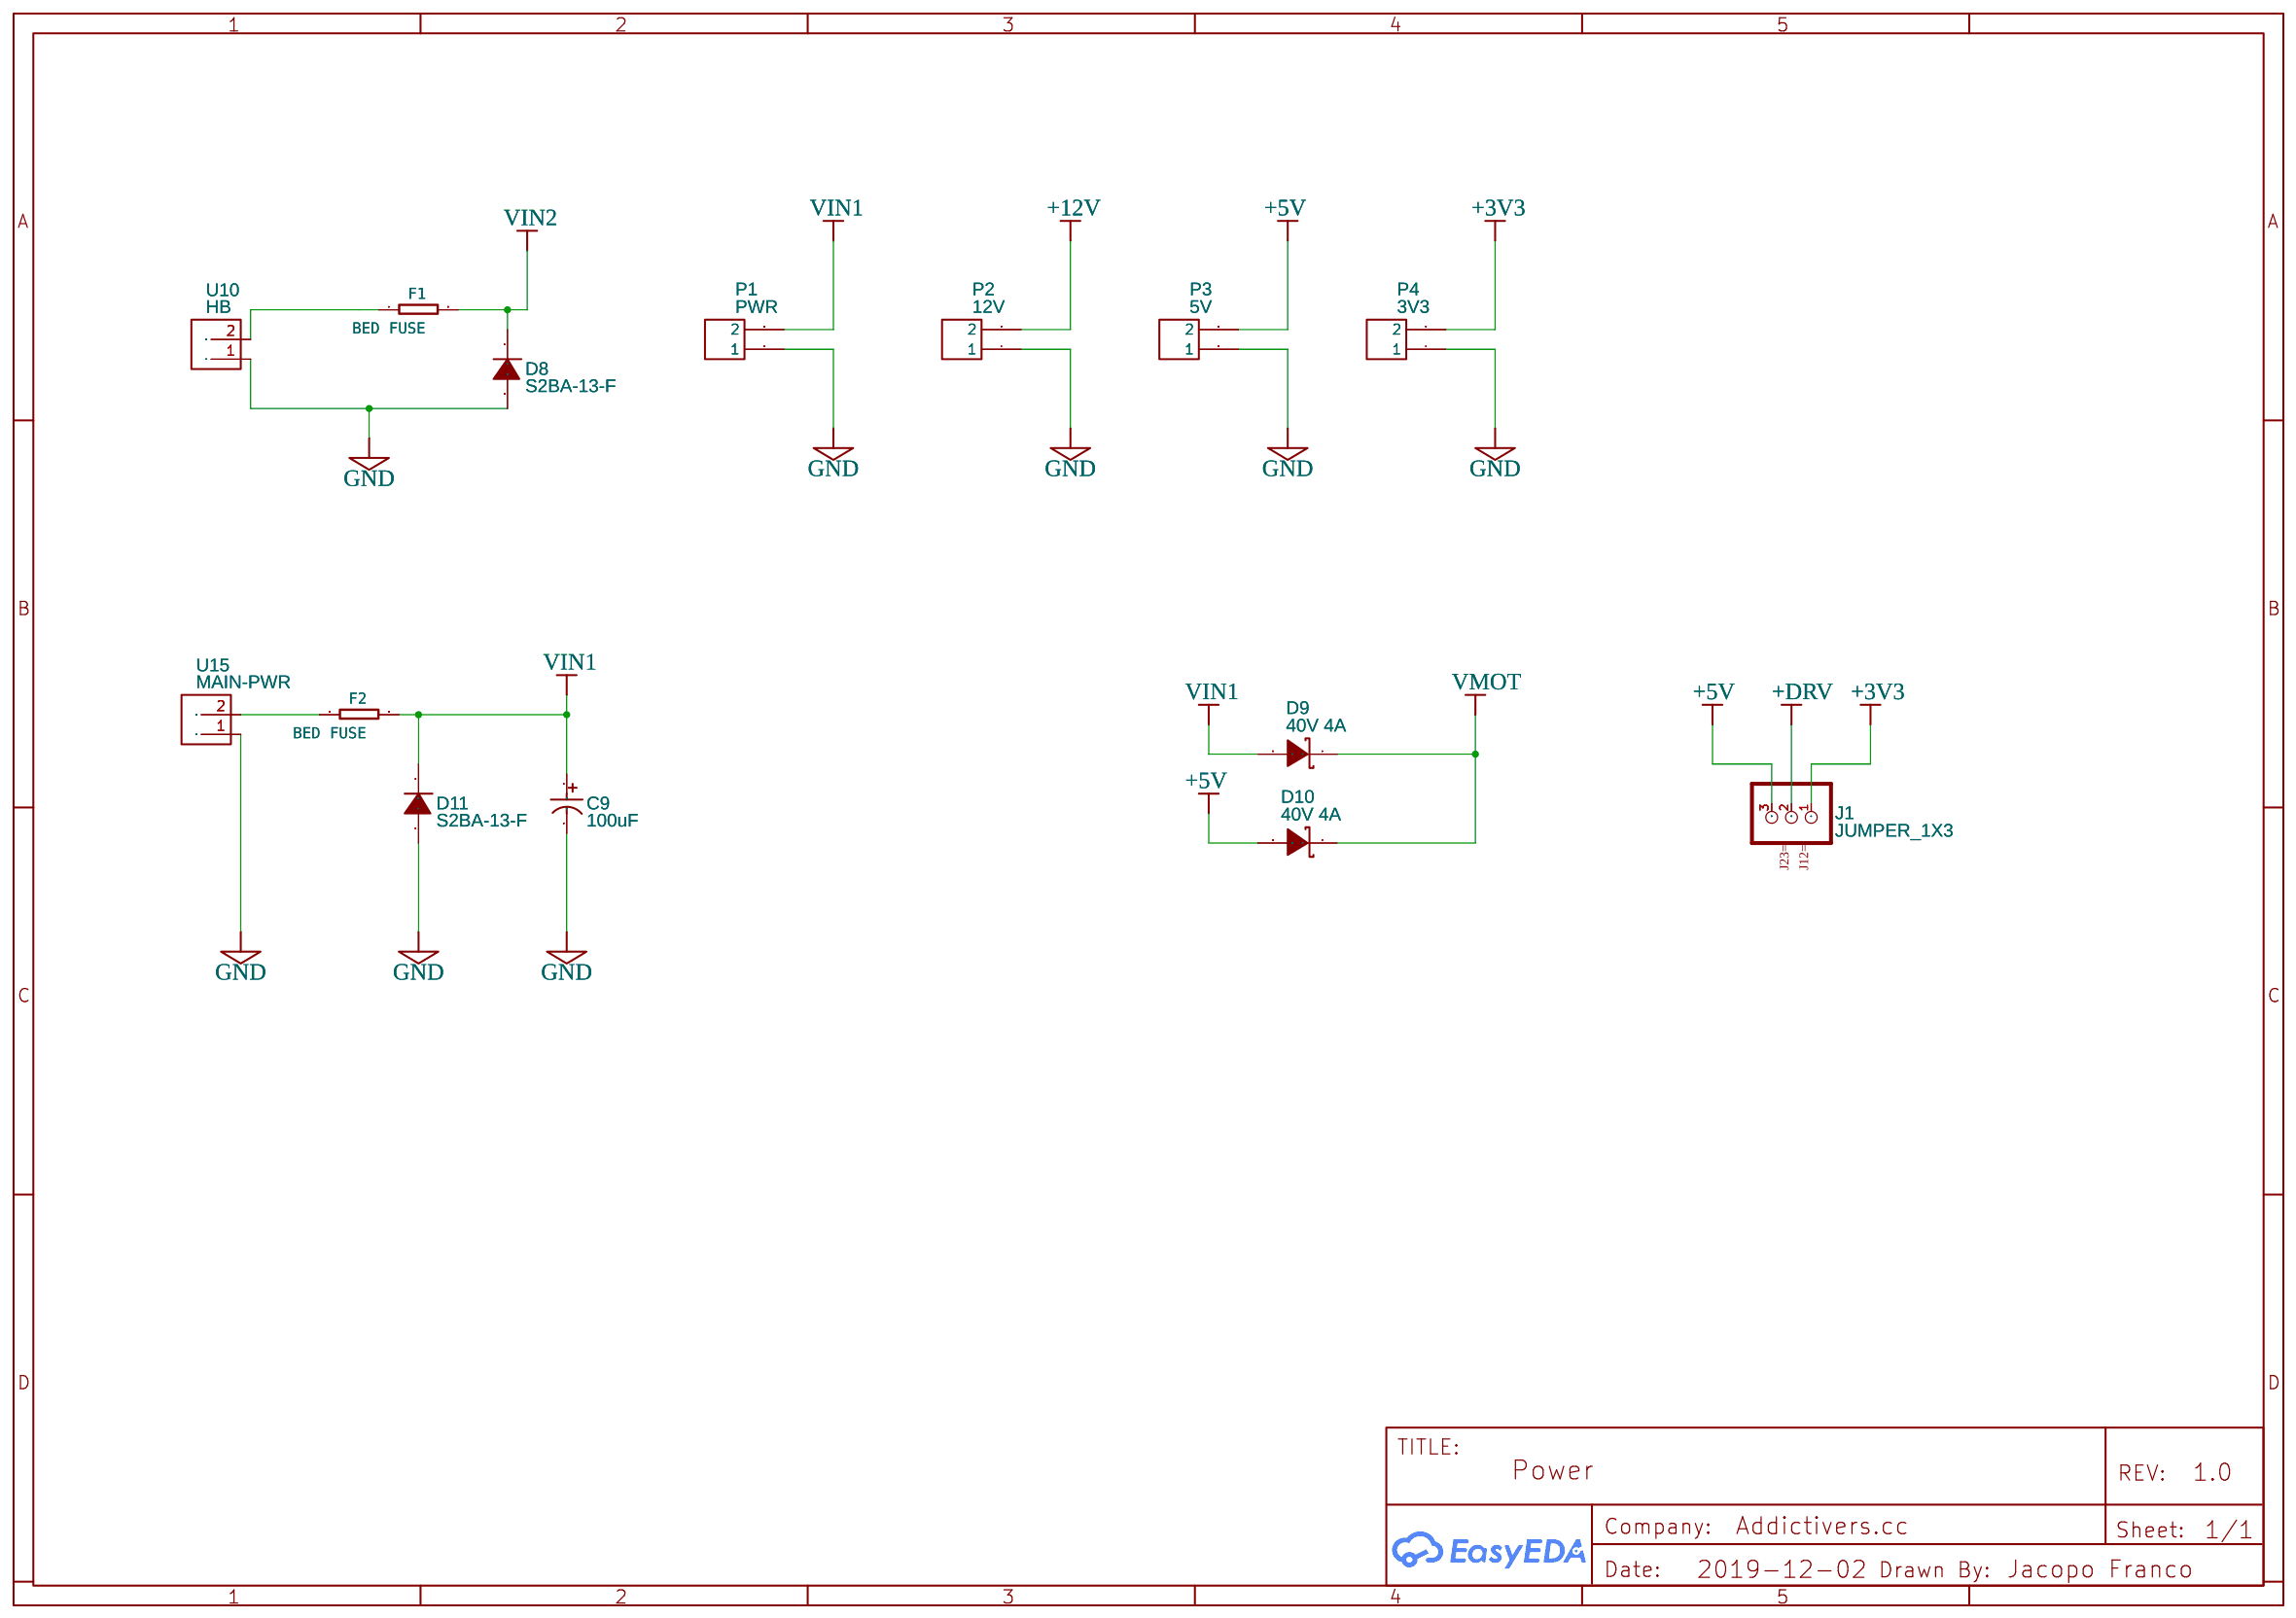
[diagram p10: Power]
12 Motor Drivers: TITLE: Motor Drivers; Date: 2019-12-03
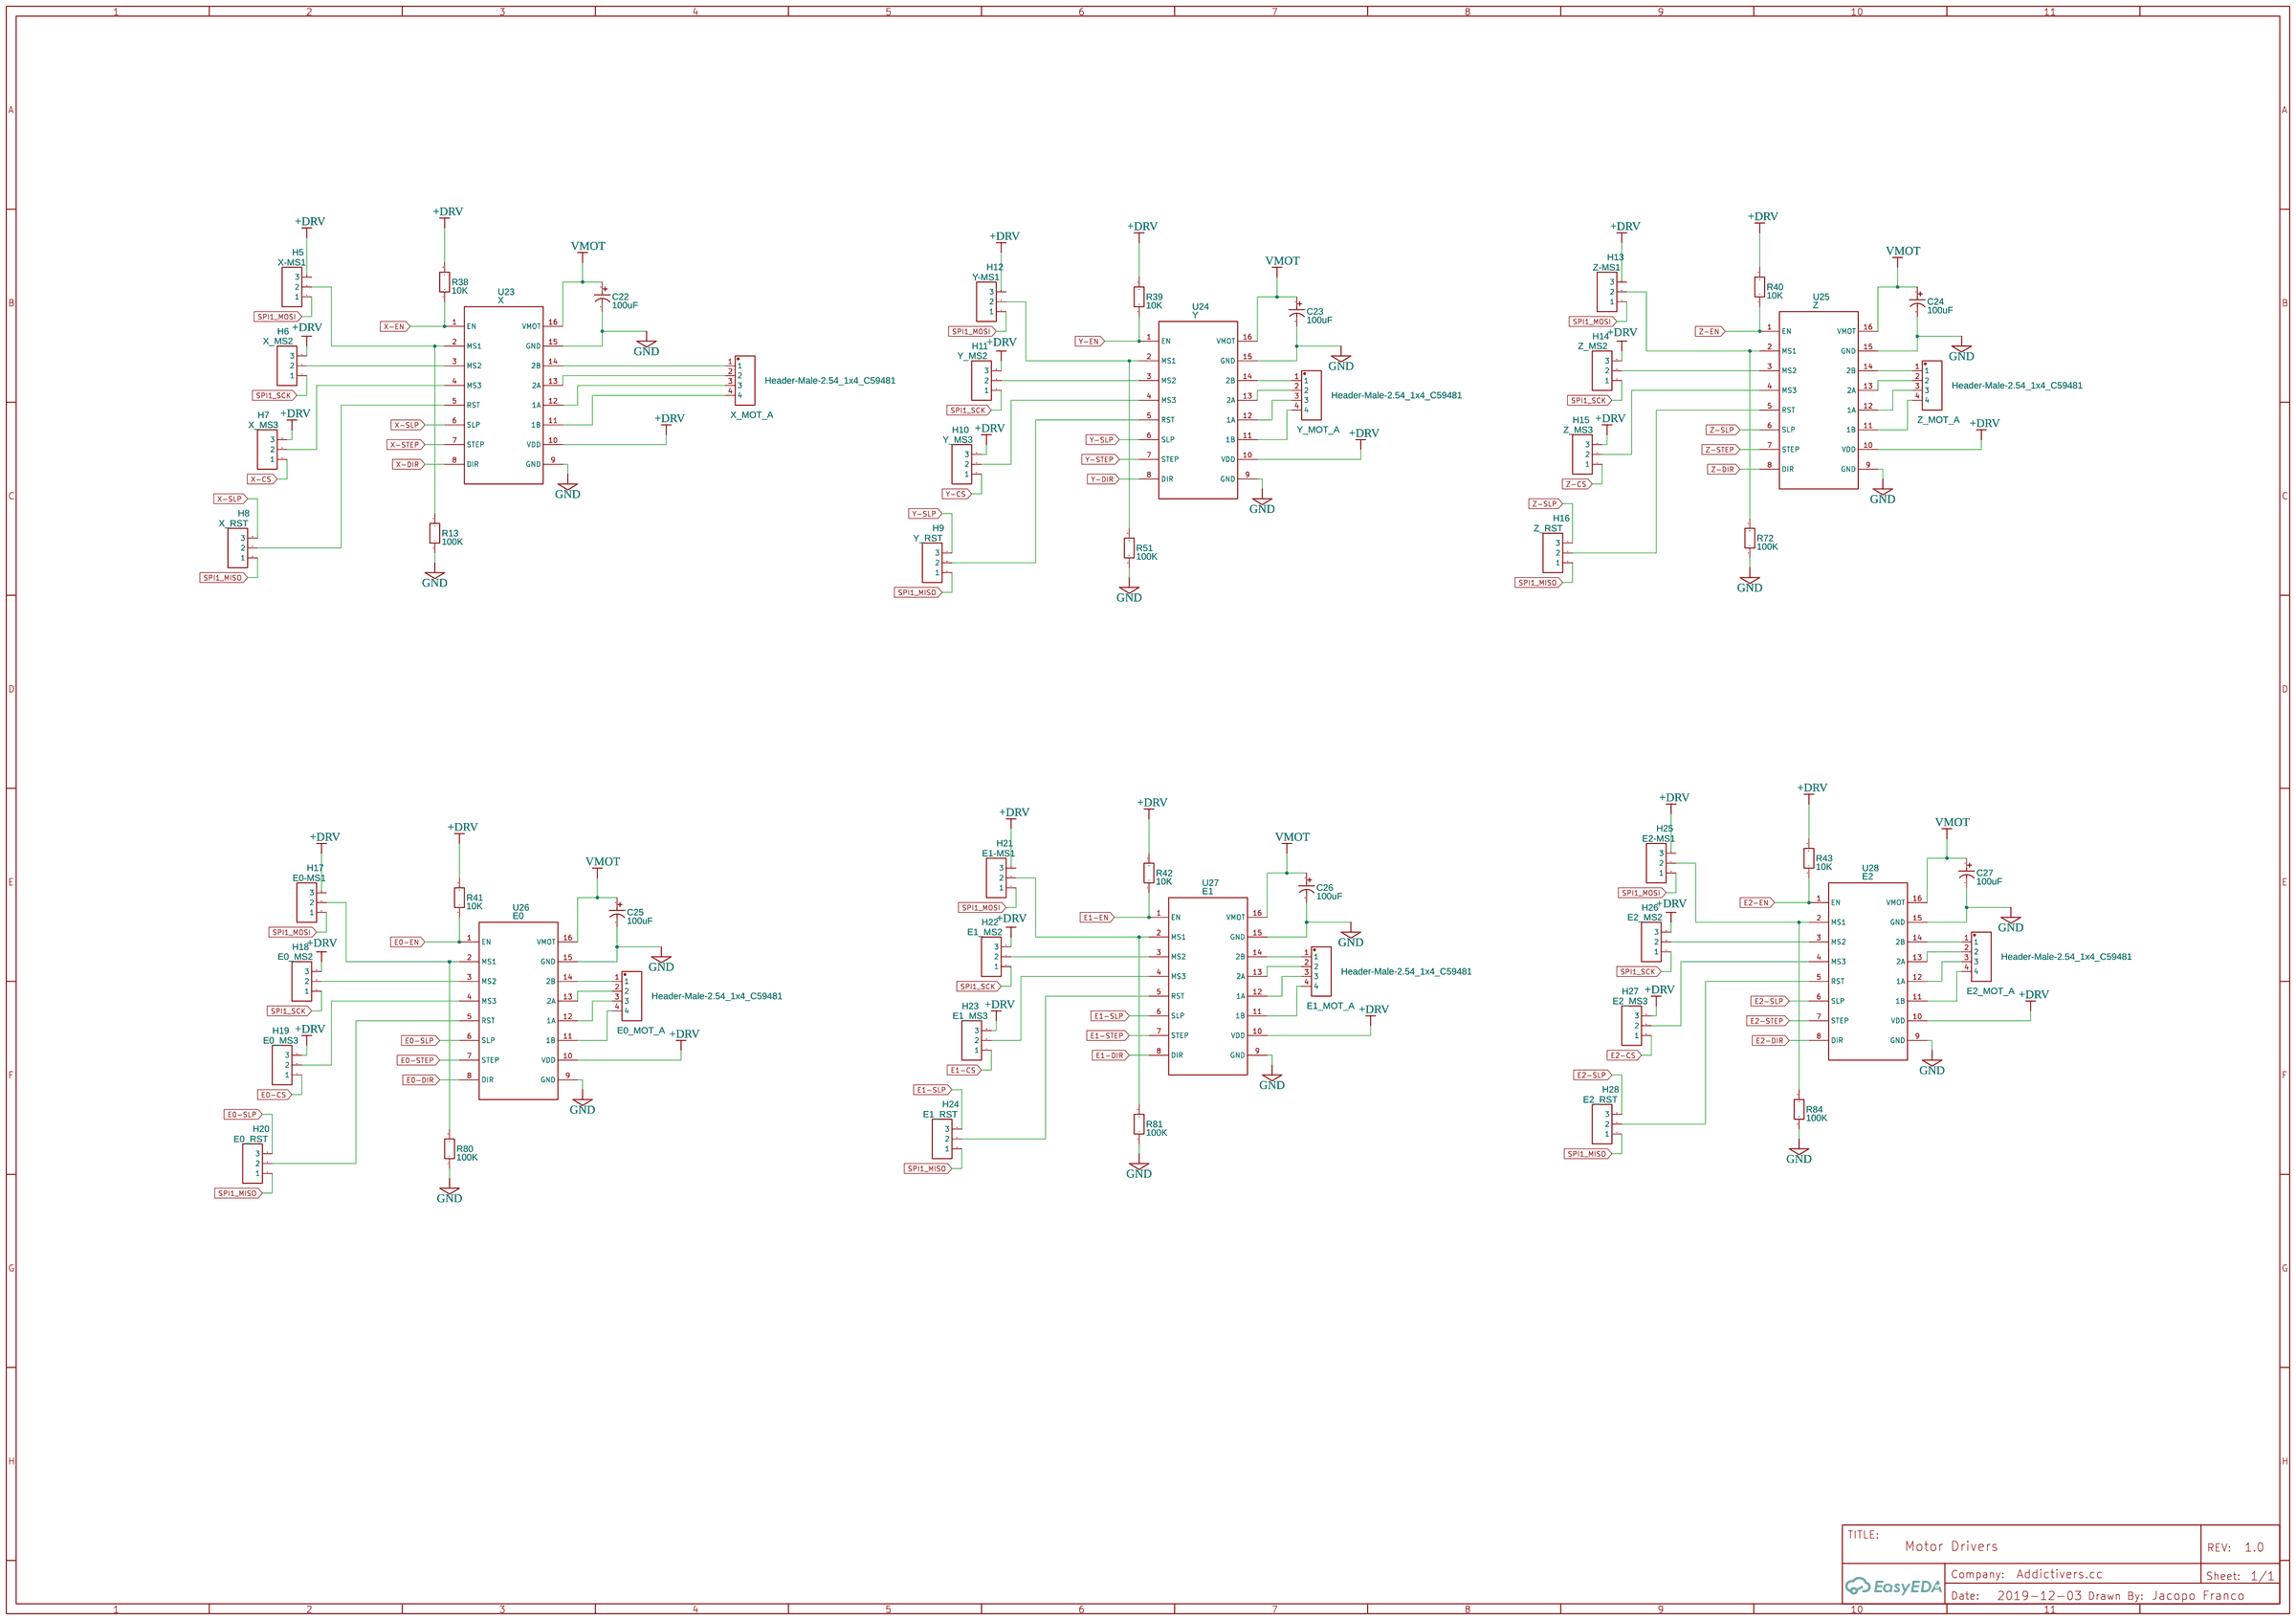
[diagram p11: Motor Drivers]
13 Voltage regulators: TITLE: Voltage Regulators; Date: 2019-12-03
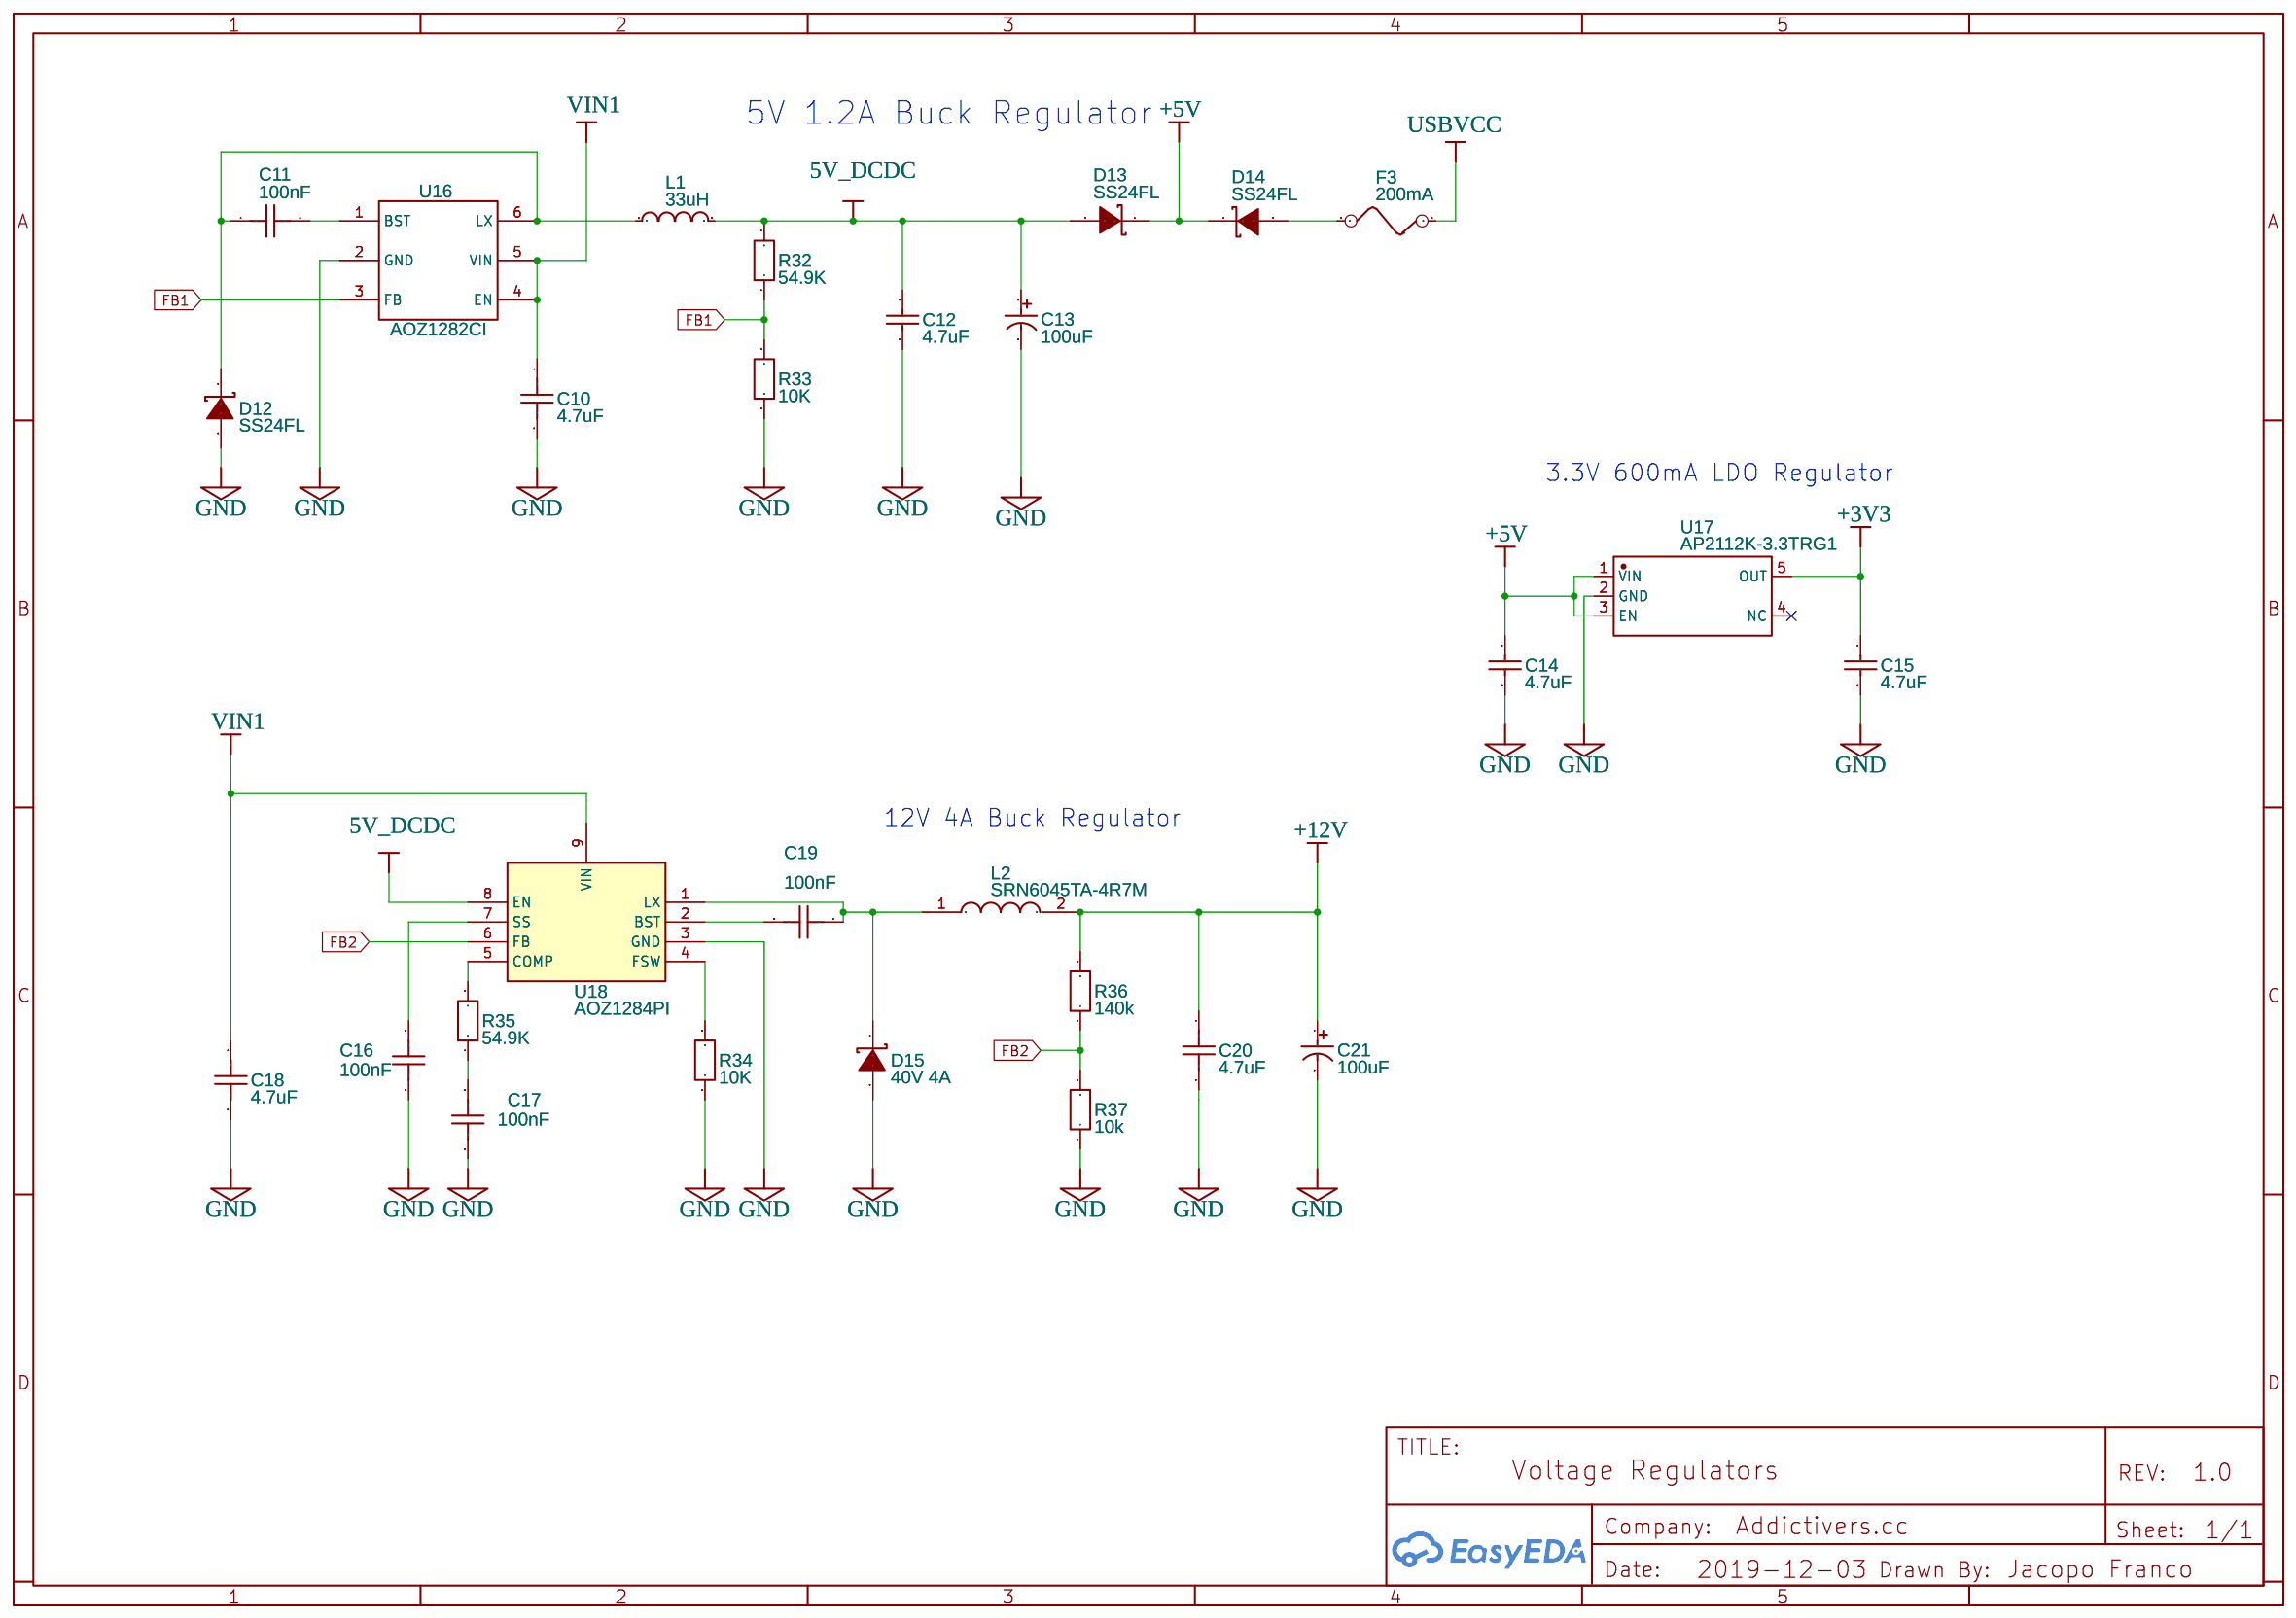
[diagram p12: Voltage regulators]
14 Comms: TITLE: Comms; Date: 2019-12-08
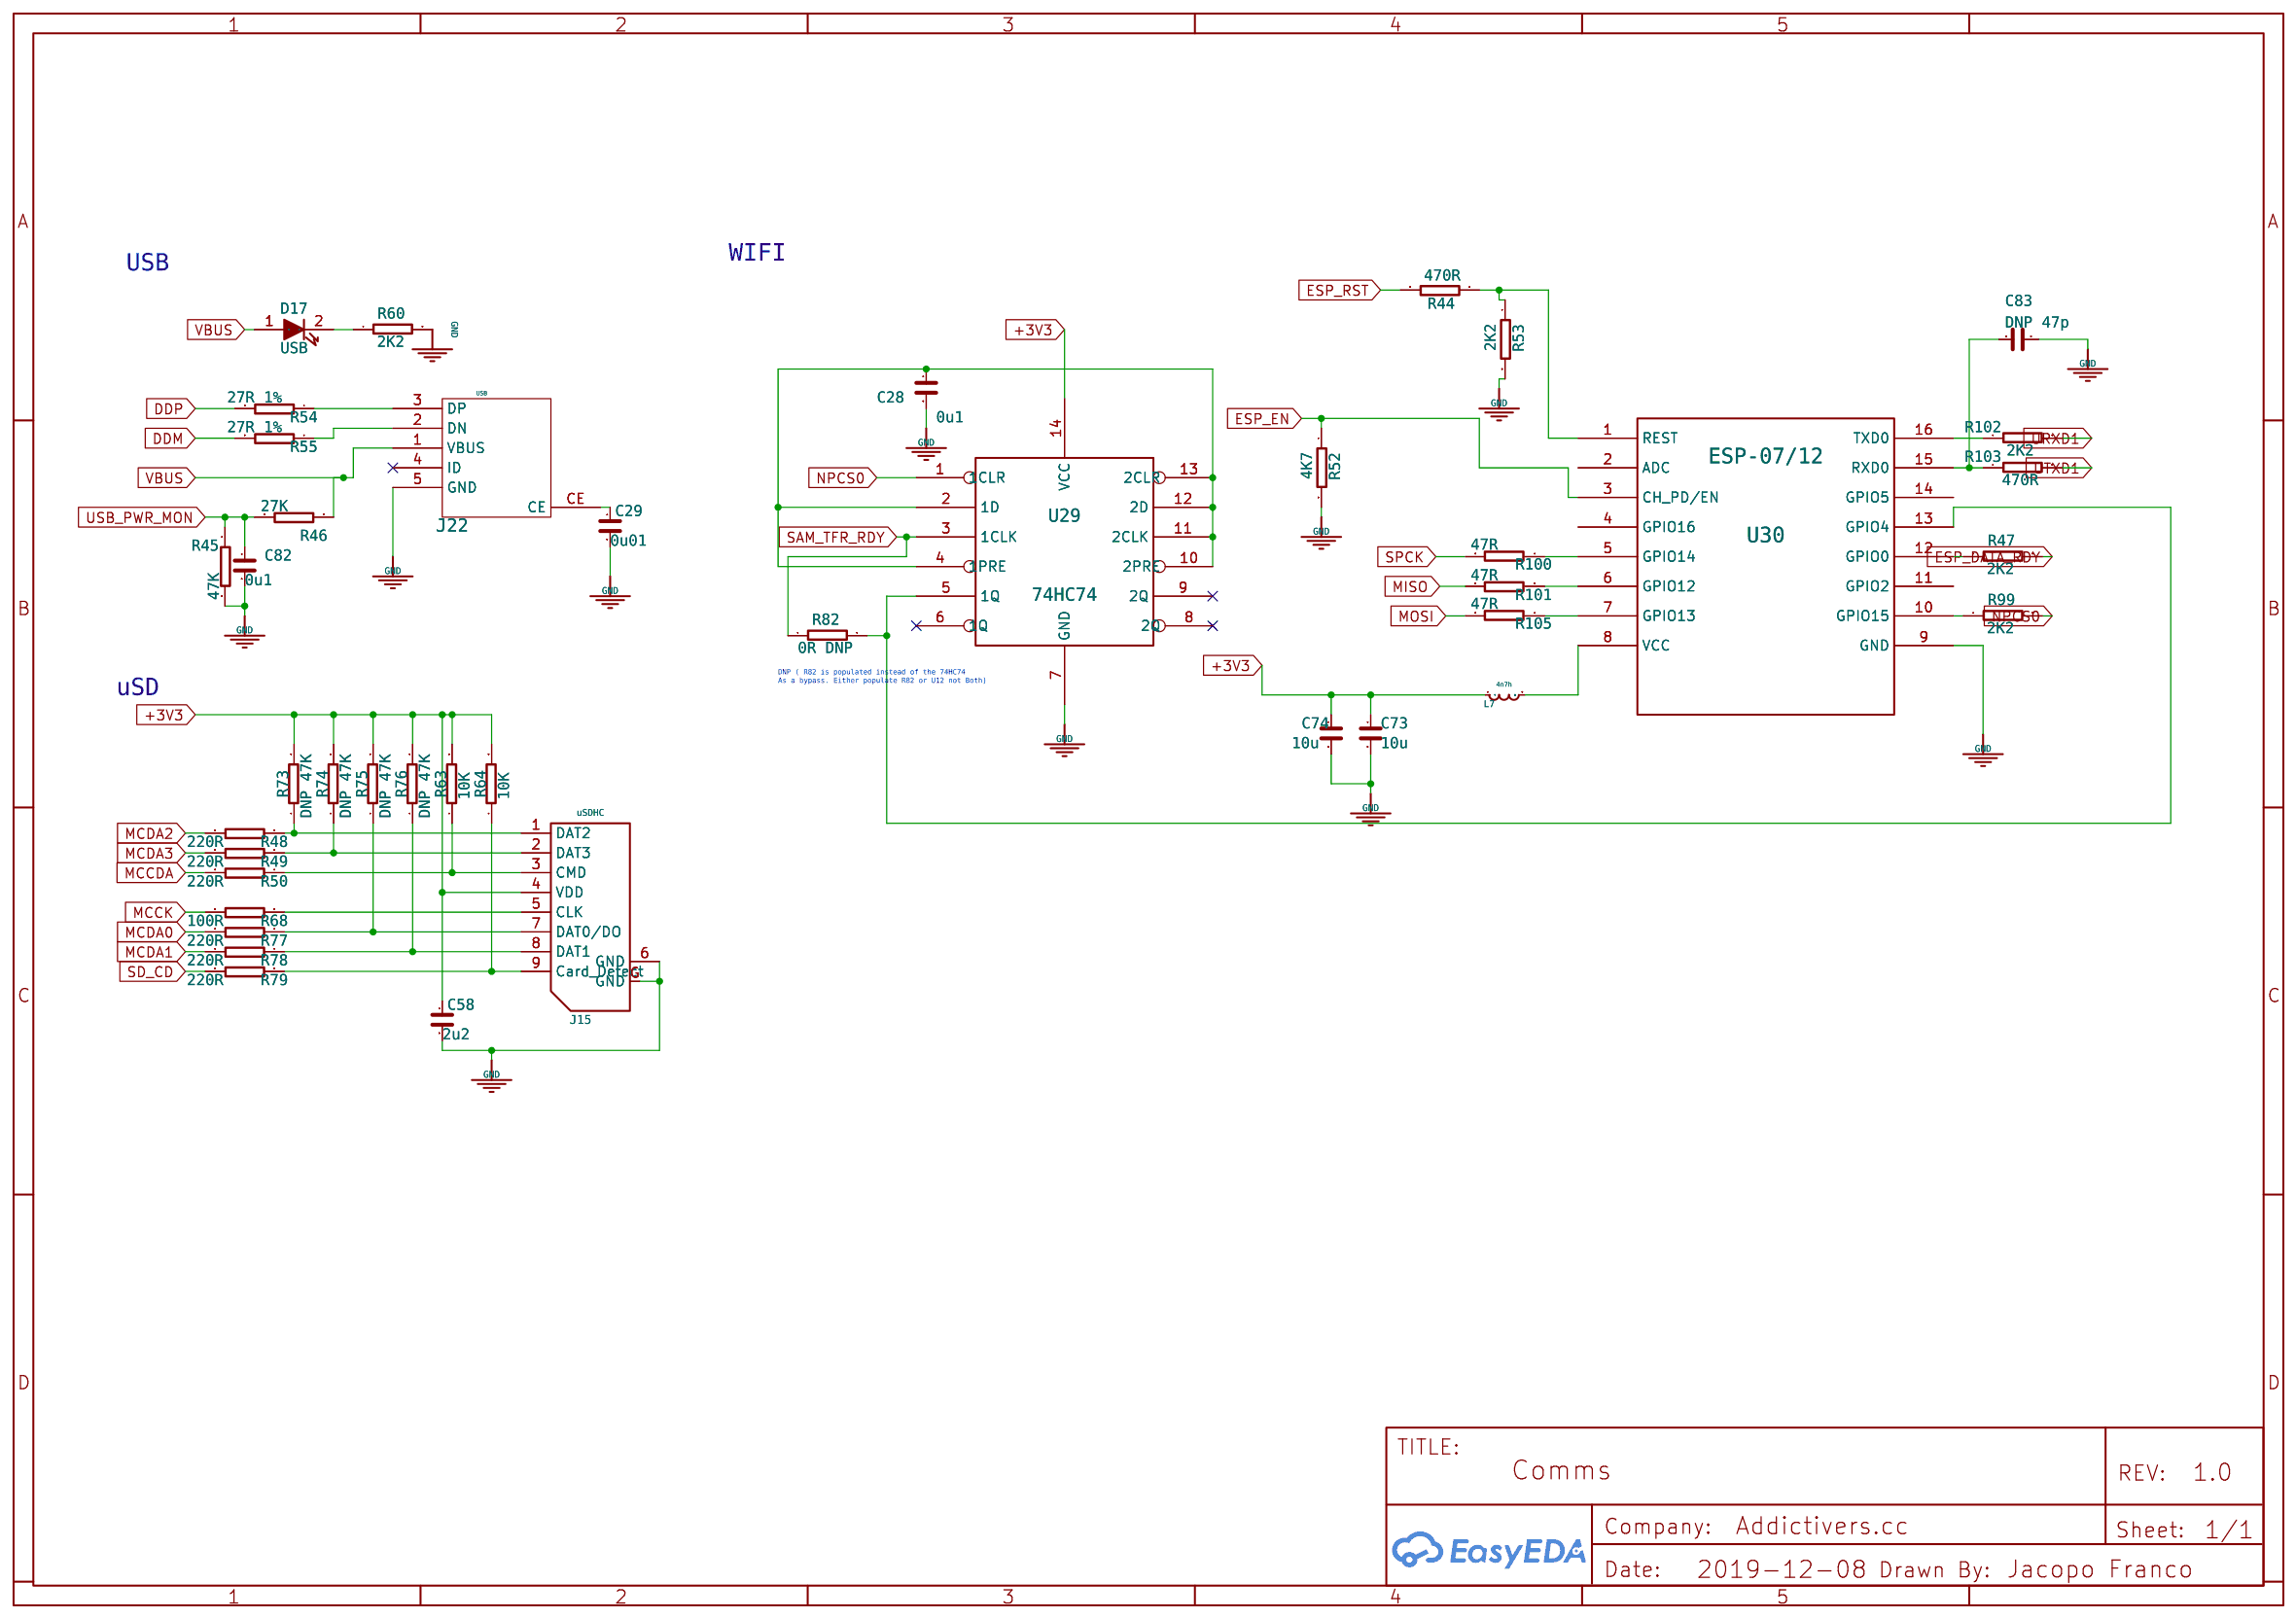
[diagram p13: Comms]

## Parts
sheet Auxiliary IO
EXP1  HDR-IDC-2.54-2X5P  [HDR-IDC-2.54-2X5P]
EXP2  HDR-IDC-2.54-2X5P  [HDR-IDC-2.54-2X5P]
EXP3  HDR-IDC-2.54-2X7P  [HDR-IDC-2.54-2X7P]
P8  PS_ON  [HDR-TH_2P-P2.54-V-M]
sheet Comms
C28  0u1  [C_0603]
C29  0u01  [C_0603]
C58  2u2  [C_0603]
C73  10u  [C_0805]
C74  10u  [C_0805]
C82  0u1  [C_0603]
C83  DNP 47p  [C_0603]
D17  USB  [D_0603]
J15  uSDHC  [USD_SKT]
J22  USB  [UUSB_NEW]
L7  4n7h  [L_0603_1608METRIC]
R44  470R  [R_0603]
R45  47K  [R_0603]
R46  27K  [R_0603]
R47  2K2  [R_0603]
R48  220R  [R_0603]
R49  220R  [R_0603]
R50  220R  [R_0603]
R52  4K7  [R_0603]
R53  2K2  [R_0603]
R54  27R 1%  [R_0603]
R55  27R 1%  [R_0603]
R60  2K2  [R_0603]
R63  10K  [R_0603]
R64  10K  [R_0603]
R68  100R  [R_0603]
R73  DNP 47K  [R_0603]
R74  DNP 47K  [R_0603]
R75  DNP 47K  [R_0603]
R76  DNP 47K  [R_0603]
R77  220R  [R_0603]
R78  220R  [R_0603]
R79  220R  [R_0603]
R82  0R DNP  [R_0603]
R99  2K2  [R_0603]
R100  47R  [R_0603]
R101  47R  [R_0603]
R102  2K2  [R_0603]
R103  470R  [R_0603]
R105  47R  [R_0603]
U29  74HC74  [TSSOP-14]
U30  ESP-07/12  [ESP-12S]
sheet EEPROM
C7  100nF  [CAP_0603]
U2  BL24C16A-RRRC  [TSOT-23-5_L2.9-W1.6-P0.95-LS2.8-BL]
sheet Endstops
X+  XH-3A  [XH-3A]
X-  XH-3A  [XH-3A]
Y+  XH-3A  [XH-3A]
Y-  XH-3A  [XH-3A]
Z+  XH-3A  [XH-3A]
Z-  XH-3A  [XH-3A]
sheet Fans
D6  S2BA-13-F  [SMA_L4.4-W2.8-LS5.4-RD]
D7  S2BA-13-F  [SMA_L4.4-W2.8-LS5.4-RD]
H1  VFAN0_SELECTOR  [HDR-TH_3P-P2.54-V]
H2  VFAN1_SELECTOR  [HDR-TH_3P-P2.54-V]
LED11  LED-Green(0603)  [LED-0603]
LED12  LED-Green(0603)  [LED-0603]
P6  FAN_0 HEAD  [HDR-TH_2P-P2.54-V-M]
P7  FAN_1 HEAD  [HDR-TH_2P-P2.54-V-M]
Q5  BUK9Y14-40B  [SOT669]
Q6  BUK9Y14-40B  [SOT669]
R26  1K  [0603]
R27  22R  [0603]
R28  100K  [0603]
R29  100K  [0603]
R30  22R  [0603]
R31  1K  [0603]
U8  FAN0  [1751248]
U9  FAN1  [1751248]
sheet Heated Bed
C8  1uF  [0603]
D5  S2BA-13-F  [SMA_L4.4-W2.8-LS5.4-RD]
LED10  LED-Green(0603)  [LED-0603]
Q4  PSMN1R8-40YLC  [SOT669]
R23  22R  [0603]
R24  100K  [0603]
R25  1K  [0603]
U6  74LVC1G17SE-7  [SOT-353_L2.2-W1.4-P0.65-LS2.4-BL]
U7  HB  [1751248]
sheet Hotends
D2  S2BA-13-F  [SMA_L4.4-W2.8-LS5.4-RD]
D3  S2BA-13-F  [SMA_L4.4-W2.8-LS5.4-RD]
D4  S2BA-13-F  [SMA_L4.4-W2.8-LS5.4-RD]
H3  VFAN1_SELECTOR  [HDR-TH_3P-P2.54-V]
LED7  LED-Green(0603)  [LED-0603]
LED8  LED-Green(0603)  [LED-0603]
LED9  LED-Green(0603)  [LED-0603]
Q1  BUK9Y14-40B  [SOT669]
Q2  BUK9Y14-40B  [SOT669]
Q3  BUK9Y14-40B  [SOT669]
R14  1K  [0603]
R15  22R  [0603]
R16  100K  [0603]
R17  100K  [0603]
R18  22R  [0603]
R19  1K  [0603]
R20  100K  [0603]
R21  22R  [0603]
R22  1K  [0603]
U3  HE0  [1751248]
U4  HE1  [1751248]
U5  HE2  [1751248]
sheet I2C Headers
ENC_1  Header-Male-2.54_1x4_C59481  [HDR-TH_4P-P2.54-V]
ENC_2  Header-Male-2.54_1x4_C59481  [HDR-TH_4P-P2.54-V]
ENC_3  Header-Male-2.54_1x4_C59481  [HDR-TH_4P-P2.54-V]
ENC_4  Header-Male-2.54_1x4_C59481  [HDR-TH_4P-P2.54-V]
sheet LEDs
LED1  LED-Green(0603)  [LED-0603]
LED2  LED-Green(0603)  [LED-0603]
LED3  LED-Green(0603)  [LED-0603]
LED4  LED-Green(0603)  [LED-0603]
LED5  LED-Green(0603)  [LED-0603]
LED6  LED-Yellow(0603)  [LED-0603]
R1  4k7  [0603]
R2  1k  [0603]
R3  1k  [0603]
R4  1K  [0603]
R5  1k  [0603]
R6  1k  [0603]
sheet Microcontroller
C1  100nF  [CAP_0603]
C30  100nF  [CAP_0603]
C31  100nF  [CAP_0603]
C32  100nF  [CAP_0603]
C33  100nF  [CAP_0603]
C34  100nF  [CAP_0603]
C35  10pF  [0603]
C36  100nF  [CAP_0603]
C37  100nF  [CAP_0603]
C38  100nF  [CAP_0603]
C39  10uF  [0805]
C40  10uF  [0805]
C41  100nF  [CAP_0603]
C42  10uF  [0805]
C43  4.7uF  [0805]
C44  10p  [C_0603]
C45  10p  [C_0603]
C46  100nF  [CAP_0603]
C47  100nF  [CAP_0603]
C48  100nF  [CAP_0603]
C49  100nF  [CAP_0603]
C50  100nF  [CAP_0603]
C51  100nF  [CAP_0603]
C52  2.2uF  [0805]
C53  10uF  [0805]
D25  SOD-523F  [SOD-523F]
F4  FSMD020-1206-R  [1206]
J21  JTAG  [MICRO_5X2]
JP1  ERASE  [JUMPER]
L5  10uH 100Mhz  [R_0603]
L6  10uH 100Mhz  [R_0603]
R9  22R  [0603]
R10  22R  [0603]
R11  2k2  [0603]
R12  2k2  [0603]
R56  1R  [R_0603]
R57  DNP 100K  [R_0603]
R58  DNP 100K  [R_0603]
R59  DNP 100K  [R_0603]
R83  10K  [R_0603]
R106  10K  [R_0603]
S1  RESET  [SW_SIDE_1_LUGS]
U1  ATSAME70Q21B-ANT  [LQFP144]
X2  CRYSTAL_4PIN  [XTAL_5X3.2]
sheet Motor Drivers
C22  100uF  [CAP-SMD_BD6.3-L6.6-W6.6-FD]
C23  100uF  [CAP-SMD_BD6.3-L6.6-W6.6-FD]
C24  100uF  [CAP-SMD_BD6.3-L6.6-W6.6-FD]
C25  100uF  [CAP-SMD_BD6.3-L6.6-W6.6-FD]
C26  100uF  [CAP-SMD_BD6.3-L6.6-W6.6-FD]
C27  100uF  [CAP-SMD_BD6.3-L6.6-W6.6-FD]
E0_MOT_A  Header-Male-2.54_1x4_C59481  [HDR-TH_4P-P2.54-V]
E1_MOT_A  Header-Male-2.54_1x4_C59481  [HDR-TH_4P-P2.54-V]
E2_MOT_A  Header-Male-2.54_1x4_C59481  [HDR-TH_4P-P2.54-V]
H5  X-MS1  [HDR-TH_3P-P2.54-V]
H6  X_MS2  [HDR-TH_3P-P2.54-V]
H7  X_MS3  [HDR-TH_3P-P2.54-V]
H8  X_RST  [HDR-TH_3P-P2.54-V]
H9  Y_RST  [HDR-TH_3P-P2.54-V]
H10  Y_MS3  [HDR-TH_3P-P2.54-V]
H11  Y_MS2  [HDR-TH_3P-P2.54-V]
H12  Y-MS1  [HDR-TH_3P-P2.54-V]
H13  Z-MS1  [HDR-TH_3P-P2.54-V]
H14  Z_MS2  [HDR-TH_3P-P2.54-V]
H15  Z_MS3  [HDR-TH_3P-P2.54-V]
H16  Z_RST  [HDR-TH_3P-P2.54-V]
H17  E0-MS1  [HDR-TH_3P-P2.54-V]
H18  E0_MS2  [HDR-TH_3P-P2.54-V]
H19  E0_MS3  [HDR-TH_3P-P2.54-V]
H20  E0_RST  [HDR-TH_3P-P2.54-V]
H21  E1-MS1  [HDR-TH_3P-P2.54-V]
H22  E1_MS2  [HDR-TH_3P-P2.54-V]
H23  E1_MS3  [HDR-TH_3P-P2.54-V]
H24  E1_RST  [HDR-TH_3P-P2.54-V]
H25  E2-MS1  [HDR-TH_3P-P2.54-V]
H26  E2_MS2  [HDR-TH_3P-P2.54-V]
H27  E2_MS3  [HDR-TH_3P-P2.54-V]
H28  E2_RST  [HDR-TH_3P-P2.54-V]
R13  100K  [0603]
R38  10K  [0603]
R39  10K  [0603]
R40  10K  [0603]
R41  10K  [0603]
R42  10K  [0603]
R43  10K  [0603]
R51  100K  [0603]
R72  100K  [0603]
R80  100K  [0603]
R81  100K  [0603]
R84  100K  [0603]
U23  X  [STEPSTICK]
U24  Y  [STEPSTICK]
U25  Z  [STEPSTICK]
U26  E0  [STEPSTICK]
U27  E1  [STEPSTICK]
U28  E2  [STEPSTICK]
X_MOT_A  Header-Male-2.54_1x4_C59481  [HDR-TH_4P-P2.54-V]
Y_MOT_A  Header-Male-2.54_1x4_C59481  [HDR-TH_4P-P2.54-V]
Z_MOT_A  Header-Male-2.54_1x4_C59481  [HDR-TH_4P-P2.54-V]
sheet Power
C9  100uF  [CAP-SMD_BD6.3-L6.6-W6.6-FD]
D8  S2BA-13-F  [SMA_L4.4-W2.8-LS5.4-RD]
D9  40V 4A  [SMB_L4.6-W3.6-LS5.3-RD]
D10  40V 4A  [SMB_L4.6-W3.6-LS5.3-RD]
D11  S2BA-13-F  [SMA_L4.4-W2.8-LS5.4-RD]
F1  BED FUSE  [MCCQ-122-MINIBLADEFUSEHOLDER]
F2  BED FUSE  [MCCQ-122-MINIBLADEFUSEHOLDER]
J1  JUMPER_1X3  [JP3_0805]
P1  PWR  [HDR-TH_2P-P2.54-V-M]
P2  12V  [HDR-TH_2P-P2.54-V-M]
P3  5V  [HDR-TH_2P-P2.54-V-M]
P4  3V3  [HDR-TH_2P-P2.54-V-M]
U10  HB  [1751248]
U15  MAIN-PWR  [1751248]
sheet Thermistors
C54  2u2  [C_0603]
C55  2u2  [C_0603]
C56  2u2  [C_0603]
C59  2u2  [C_0603]
C60  2u2  [C_0603]
P9  XH-2A  [XH-2A]
P10  XH-2A  [XH-2A]
P11  XH-2A  [XH-2A]
P12  XH-2A  [XH-2A]
P13  XH-2A  [XH-2A]
R7  4K7 0.1%  [R_0603]
R8  4K7 0.1%  [R_0603]
R61  4K7 0.1%  [R_0603]
R62  4K7 0.1%  [R_0603]
R65  10K  [R_0603]
R66  10K  [R_0603]
R67  10K  [R_0603]
R69  4K7 0.1%  [R_0603]
R70  10K  [R_0603]
R71  10K  [R_0603]
sheet Voltage regulators
C10  4.7uF  [1210]
C11  100nF  [CAP_0603]
C12  4.7uF  [0603]
C13  100uF  [CAP-SMD_BD6.3-L6.6-W6.6-FD]
C14  4.7uF  [0603]
C15  4.7uF  [0603]
C16  100nF  [CAP_0603]
C17  100nF  [CAP_0603]
C18  4.7uF  [1210]
C19  100nF  [CAP_0603]
C20  4.7uF  [1210]
C21  100uF  [CAP-SMD_BD6.3-L6.6-W6.6-FD]
D12  SS24FL  [SMA_L4.4-W2.8-LS5.4-RD]
D13  SS24FL  [SMA_L4.4-W2.8-LS5.4-RD]
D14  SS24FL  [SMA_L4.4-W2.8-LS5.4-RD]
D15  40V 4A  [SMB_L4.6-W3.6-LS5.3-RD]
F3  200mA  [0603]
L1  33uH  [SRN6045TA-3R3Y]
L2  SRN6045TA-4R7M  [SRN6045TA4R7M]
R32  54.9K  [0603]
R33  10K  [0603]
R34  10K  [0603]
R35  54.9K  [0603]
R36  140k  [0603]
R37  10k  [0603]
U16  AOZ1282CI  [SOT-23-6_L2.9-W1.6-P0.95-LS2.8-BL]
U17  AP2112K-3.3TRG1  [SOT-25_5PIN_L3.10-W3.00-PITCH0.95-BR]
U18  AOZ1284PI  [SOP-8_EP_150MIL]

## Library data of the parts
EXP1 EXP2 = -: Supplier: LCSC; Manufacturer: BOOMELE; Manufacturer Part: IDC Box 2.54mm 2X5P; image: //image.lceda.cn/szlcsc/C5665.jpg; Supplier Part: C5665
EXP3 = -: Supplier: LCSC; Manufacturer: BOOMELE; Manufacturer Part: 2X7 2.54mm IDC Box; image: //image.lceda.cn/szlcsc/C11215.jpg; Supplier Part: C11215
P1-P4 P6-P8 = -: Supplier: LCSC; Manufacturer: ReliaPro; Manufacturer Part: 2.54mm 1*2P; image: http://image.lceda.cn/szlcsc/C36717.jpg; Supplier Part: C36717
C1 C7 C11 C16 C17 C19 C30-C34 C36-C38 C41 C46-C51 = CGA3E3X8R1H104KT0Y0N: Supplier: LCSC; Supplier Part: C342825; Manufacturer: TDK; Contributor: LCSC
U2 = -: Supplier: LCSC; Supplier Part: C191945; Manufacturer: Shanghai Belling; Contributor: LCSC
X+ X- Y+ Y- Z+ Z- = -: Supplier: LCSC; Manufacturer: BOOMELE; image: //image.lceda.cn/szlcsc/C2316.jpg; Supplier Part: C2316
D2-D8 D11 = -: Supplier: LCSC; Supplier Part: C150463; Manufacturer: Diodes Incorporated; Contributor: LCSC; LCSC Assembly: Yes; SMT Type: Extend
H1-H3 H5-H28 = -: Supplier: LCSC; Manufacturer: BOOMELE; Manufacturer Part: Header2.54mm 1*3P; image: //image.lceda.cn/szlcsc/C49257.jpg; Supplier Part: C49257
LED1-LED5 LED7-LED12 = -: Supplier: LCSC; Manufacturer: Foshan NationStar Optoelectronics; Manufacturer Part: FC-DA1608UGK-520D10; Contributor: EasyEDA; Supplier Part: C84267
Q1-Q6 = PH7030L: N-channel TrenchMOS (TM) logic level FET
R1-R6 R9-R43 R51 R72 R80 R81 R84 = Res_0603(1/10W)_EU
U3-U5 U7-U10 U15 = -: Manufacturer Part: 2-pin terminal; Contributor: cycletap; link: https://www.alliedelec.com/phoenix-contact-1751248/70054346/
C8 = CL10B105KO8NNNC: Supplier: LCSC; Manufacturer: SAMSUNG; Supplier Part: C59782
U6 = -: Supplier: LCSC; Supplier Part: C212314; Manufacturer: Diodes Incorporated; Contributor: LCSC
E0_MOT_A E1_MOT_A E2_MOT_A ENC_1-ENC_4 X_MOT_A Y_MOT_A Z_MOT_A = -: Supplier: LCSC; Manufacturer: ReliaPro; Manufacturer Part: Headers  Pins 1*4P; image: http://image.lceda.cn/szlcsc/C59481.jpg; Supplier Part: C59481
LED6 = -: Supplier: LCSC; Manufacturer: EVERLIGHT; Manufacturer Part: 19-213/Y2C-CQ2R2L/3T(CY); Supplier Part: C72038
C35 = CC0603GRNPO9BN100: Supplier: LCSC; Supplier Part: C325468; Manufacturer: YAGEO; Contributor: LCSC
C39 C40 C42 C53 = CL21A106KAYNNNE: Supplier: LCSC; Manufacturer: SAMSUNG; LCSC Assembly: Yes; Supplier Part: C15850; SMT Type: Basic
C43 = C2012X7R1E475KT000N: Supplier: LCSC; Manufacturer: TDK; Supplier Part: C76642
C52 = CL21B225KAFNFNE: Supplier: LCSC; Supplier Part: C364318; Manufacturer: Samsung Electro-Mechanics; Contributor: LCSC
F4 = -: Supplier: LCSC; Supplier Part: C220145; Manufacturer: Fuzetec Tech; Contributor: LCSC
U1 = -: Datasheet: https://www.mouser.co.uk/datasheet/2/268/SAM-E70-S70-V70-V71-Family-Data-Sheet-DS60001527D-1660339.pdf; Package Display: No; Manufacturer: Microchip
X2 = -: Frequency: 12MHz
C9 C13 C21-C27 = EEEFT1V101AP: Supplier: LCSC; Manufacturer: PANASONIC; Supplier Part: C128464
U23-U28 = -: Manufacturer: XIND; Manufacturer Part: A4988; Supplier Part: 34059; link: https://www.belchip.by/product/?selected_product=34059; Contributor: Andrei Maroz
D9 D10 D15 = -: Supplier: Digi-Key; Manufacturer: VISHAY; Manufacturer Part: SSB44-E3/52T; Contributor: LCSC; Supplier Part: SSB44-E3/52TGICT-ND; LCSC Assembly: Yes; SMT Type: Extend
J1 = -: Contributor: DangerousPrototype
P9-P13 = -: Supplier: LCSC; Manufacturer: BOOMELE; image: //image.lceda.cn/szlcsc/C20079.jpg; Supplier Part: C20079
C10 C18 C20 = C1210X475K101T: Supplier: LCSC; Supplier Part: C337978; Manufacturer: Holy Stone Enterprise; Contributor: LCSC
C12 C14 C15 = -: Supplier Part: 445-1604-1-ND; Supplier: Digi-Key; Manufacturer: TDK; Contributor: Hamza Javed
D12-D14 = -: Supplier: LCSC; Manufacturer: SK; Supplier Part: C111630; LCSC Assembly: Yes; SMT Type: Extend
F3 = -: Manufacturer Part: 0ZCM0020FF2G; Supplier Part: 507-1821-1-ND; Manufacturer: Bel Fuse Inc.; Supplier: Digi-Key
L1 = -: Manufacturer: Bourns; Manufacturer Part: SRN6045TA-330M; Supplier: Mouser; Supplier Part: SRN6045TA-330MCT-ND; Contributor: lucastalves
L2 = -: Contributor: Carlos Schelim; Supplier Part: SRN6045TA-4R7MCT-ND; Manufacturer: Bourns Inc.; Supplier: Digi-Key
U16 = -: Supplier: LCSC; Manufacturer: AOS; Supplier Part: C111916; LCSC Assembly: Yes; SMT Type: Extend
U17 = -: Supplier: LCSC; Manufacturer: DIODES; Contributor: LCSC; Supplier Part: C51118; LCSC Assembly: Yes; SMT Type: Extend
U18 = -: Supplier: LCSC; Manufacturer: AOS; image: //image.lceda.cn/szlcsc/C48060.jpg; Supplier Part: C48060; LCSC Assembly: Yes; SMT Type: Extend

## Nets
5V_DCDC: C12.1 C13.1 D13.2(A) L1.2 R2.2 R32.2 U18.8(EN)
+3V3: C1.2 C7.2 C15.1 C31.2 C32.2 C33.2 C34.2 C36.2 C37.2 C38.2 C39.2 C40.2 C58.1 C73.1 C74.1 J1.1 J15.4(VDD) J21.1(VDD) JP1.1 L5.2(B) L7.1(A) LED5.1(+) P4.2 R11.2 R12.2 R57.1 R58.1 R59.1 R63.2 R64.2 R73.2 R74.2 R75.2 R76.2 R106.2 U1.5(VDDIN) U1.30(VDDIO) U1.43(VDDIO) U1.72(VDDIO) U1.80(VDDIO) U1.96(VDDIO) U1.134(VDDIO) U1.143(VDDIO) U2.4(VCC) U17.5(OUT) U29.14(VCC) X+.3 X-.3 Y+.3 Y-.3 Z+.3 Z-.3
+5V: C8.2 C14.1 D10.2(A) D13.1(C) D14.1(C) ENC_1.4 ENC_2.4 ENC_3.4 ENC_4.4 EXP1.10 EXP3.13 J1.3 LED4.1(+) P3.2 U6.1(NC) U17.1(VIN) U17.3(EN)
+12V: C20.1 C21.1 EXP3.14 H1.3 H2.3 H3.3 L2.2 LED1.1(+) P2.2 R36.2
GND: C1.1 C7.1 C8.1 C9.2 C10.2 C12.2 C13.2 C14.2 C15.2 C16.1 C17.1 C18.2 C20.2 C21.2 C22.2 C23.2 C24.2 C25.2 C26.2 C27.2 C28.2 C29.2 C30.1 C31.1 C32.1 C33.1 C34.1 C35.1 C36.1 C37.1 C38.1 C39.1 C40.1 C41.1 C42.1 C43.1 C44.2 C45.2 C46.1 C47.1 C48.1 C49.1 C50.1 C51.1 C52.2 C53.1 C54.2 C55.2 C56.2 C58.2 C59.2 C60.2 C73.2 C74.2 C82.2 C83.2 D8.2(A) D11.2(A) D12.2(A) D15.2(A) ENC_1.3 ENC_2.3 ENC_3.3 ENC_4.3 EXP1.9 EXP2.9 EXP3.11 EXP3.12 F4.2 J15.6(GND) J15.G(GND) J21.3(GND) J21.5(GND) J21.9(GND) J22.5(GND) LED2.2(-) LED3.2(-) LED6.2(-) LED7.2(-) LED8.2(-) LED9.2(-) LED10.2(-) LED11.2(-) LED12.2(-) P1.1 P2.1 P3.1 P4.1 P8.2 P9.2 P10.2 P11.2 P12.2 P13.2 Q1.1(S) Q1.2(S) Q1.3(S) Q2.1(S) Q2.2(S) Q2.3(S) Q3.1(S) Q3.2(S) Q3.3(S) Q4.1(S) Q4.2(S) Q4.3(S) Q5.1(S) Q5.2(S) Q5.3(S) Q6.1(S) Q6.2(S) Q6.3(S) R1.1 R4.1 R5.1 R13.1 R16.1 R17.1 R20.1 R24.1 R28.1 R29.1 R33.1 R34.1 R37.1 R45.2 R51.1 R52.2 R53.2 R60.2 R72.1 R80.1 R81.1 R84.1 S1.1 S1.2 U1.8(GND) U1.44(GND) U1.61(GND) U1.85(TEST) U1.95(GND) U1.104(JTAGSEL) U1.115(GND) U1.135(GND) U1.138(GND) U2.2(GND) U2.5(WP) U6.3(GND) U10.1 U15.1 U16.2(GND) U17.2(GND) U18.3(GND) U23.9(GND) U23.15(GND) U24.9(GND) U24.15(GND) U25.9(GND) U25.15(GND) U26.9(GND) U26.15(GND) U27.9(GND) U27.15(GND) U28.9(GND) U28.15(GND) U29.7(GND) U30.9(GND) X2.2 X2.4 X+.2 X-.2 Y+.2 Y-.2 Z+.2 Z-.2
VBUS: D17.1(A) J22.1(VBUS) R46.1
VDDCORE: C30.2 C46.2 C47.2 C48.2 C49.2 C50.2 C51.2 C52.1 C53.2 L6.1(A) U1.3(VDDOUT) U1.29(VDDCORE) U1.33(VDDCORE) U1.50(VDDCORE) U1.81(VDDCORE) U1.107(VDDCORE) U1.123(VDDCORE)
VIN1: C9.1 C10.1 C18.1 D2.1(C) D3.1(C) D9.2(A) D11.1(C) F2.2 H1.1 H2.1 H3.1 P1.2 U3.1 U4.1 U16.4(EN) U16.5(VIN) U18.9(VIN)
VIN2: D5.1(C) D8.1(C) F1.2 U7.1
VSSA: F4.1 R83.1
+DRV: H5.3 H6.3 H7.3 H10.3 H11.3 H12.3 H13.3 H14.3 H15.3 H17.3 H18.3 H19.3 H21.3 H22.3 H23.3 H25.3 H26.3 H27.3 J1.2 R38.2 R39.2 R40.2 R41.2 R42.2 R43.2 U23.10(VDD) U24.10(VDD) U25.10(VDD) U26.10(VDD) U27.10(VDD) U28.10(VDD)
A10: EXP3.7
ADVREF: C41.2 L5.1(A) R7.2 R8.2 R61.2 R62.2 R69.2 U1.9(ADVREF)
BEEPER: EXP1.1
BTN_EN1: EXP2.5
BTN_EN2: EXP2.3
BTN_ENC: EXP1.2 U1.48(PC7)
CS3: U1.117(PC19)
CS4: U1.120(PC20)
DDM: R55.2 U1.136(DDM)
DDP: R54.2 U1.137(DDP)
E0-CS: H19.1 U1.55(PD24)
E0-DIR: U1.99(PA1) U26.8(DIR)
E0-EN: R41.1 U1.103(PC17) U26.1(EN)
E0-SLP: H20.3 U26.6(SLP)
E0-STEP: U1.125(PD5) U26.7(STEP)
E1-CS: H23.1 U1.52(PD25)
E1-DIR: U1.110(PD9) U27.8(DIR)
E1-EN: R42.1 U1.133(PC25) U27.1(EN)
E1-SLP: H24.3 U27.6(SLP)
E1-STEP: U1.126(PD4) U27.7(STEP)
E2-CS: H27.1 U1.53(PD26)
E2-DIR: U1.71(PD28) U28.8(DIR)
E2-EN: R43.1 U1.57(PD23) U28.1(EN)
E2-SLP: H28.3 U28.6(SLP)
E2-STEP: U1.131(PD2) U28.7(STEP)
ERASE: JP1.2 U1.87(ERASE)
ESP_DATA_RDY: R47.2 U1.2(PD31)
ESP_EN: R52.1 U1.28(PE5) U30.3(CH_PD/EN)
ESP_RST: R44.2 U1.27(PE4)
FAN_0: R26.2 R27.2 R28.2 U1.49(TIOA1)
FAN_1: R29.2 R30.2 R31.2 U1.58(TIOA6)
FB1: R32.1 R33.2 U16.3(FB)
FB2: R36.1 R37.2 U18.6(FB)
HB: R23.2 R24.2 R25.1 U1.23(PWML0)
HE_0: R14.2 R15.2 R16.2 U1.22(PWML1)
HE_1: R17.2 R18.2 R19.2 U1.45(PWML2)
HE_2: R20.2 R21.2 R22.2 U1.40(PWML3)
KILL: EXP2.10 U1.124(PC22)
LCD_D4: EXP1.5 U1.63(PD21)
LCD_D5: EXP1.6 U1.65(PD20)
LCD_D6: EXP1.7 U1.67(PD19)
LCD_D7: EXP1.8 U1.69(PD18)
LCD_ENA: EXP1.3 U1.59(PA25)
LCD_RS: EXP1.4 U1.76(PC28)
LED: R6.2 U1.47(PD27)
MCCDA: R50.2 U1.112(MCCDA)
MCCK: R68.2 U1.129(MCCK)
MCDA0: R77.2 U1.116(MCDA0)
MCDA1: R78.2 U1.118(MCDA1)
MCDA2: R48.2 U1.62(MCDA2)
MCDA3: R49.2 U1.70(MCDA3)
MISO: R101.2 U1.68(MISO)
MOSI: R105.2 U1.42(MOSI)
NPCS0: R99.2 U1.64(NPCS0) U29.1(1CLR)
PB4/TDI: J21.8(TDI) R57.2 U1.105(PB4/TDI)
PB5/TDO: J21.6(TDO) U1.109(PB5/TDO)
PB6/TMS: J21.2(TMS) R59.2 U1.79(PB6/TMS)
PB7/TCK: J21.4(TCK) R58.2 R83.2 U1.89(PB7/TCK)
PD30: EXP3.1 U1.34(PD30)
PS_ON: P8.1 U1.132(PD1)
PWM_1: EXP3.10
PWM_2: EXP3.9
RESET: D25.2(A) EXP2.8 J21.10(*RST) R106.1 U1.83(NRST)
SAM_TFR_RDY: R82.1 U1.60(PD22) U29.3(1CLK)
SCL: ENC_1.1 ENC_2.1 ENC_3.1 ENC_4.1 EXP3.6 R9.1 R11.1 U2.1(SCL)
SD_CD: R79.2 U1.122(PC21)
SD_CSEL: EXP2.4
SD_DET: EXP2.7
SDA: ENC_1.2 ENC_2.2 ENC_3.2 ENC_4.2 EXP3.5 R10.1 R12.1 U2.3(SDA)
SPCK: R100.2 U1.51(SPCK)
SPI0_CS0: U1.130(PC24/TIOB3)
SPI0_CS1: U1.26(CTS0)
SPI0_CS2: U1.111(PC18)
SPI0_MISO: U1.21(RXD0)
SPI0_MOSI: U1.20(TXD0)
SPI0_SCK: U1.144(SCK0/DAC0)
SPI1_MISO: EXP2.1 H8.1 H9.1 H16.1 H20.1 H24.1 H28.1 U1.32(RXD1)
SPI1_MOSI: EXP2.6 H5.1 H12.1 H13.1 H17.1 H21.1 H25.1 U1.37(TXD1)
SPI1_SCK: EXP2.2 H6.1 H11.1 H14.1 H18.1 H22.1 H26.1 U1.46(SCK1)
THERM0: C54.1 R67.2 U1.15(AFE0_AD10)
THERM1: C55.1 R66.2 U1.16(AFE0_AD9)
THERM2: C56.1 R65.2 U1.17(AFE0_AD8)
THERM3: C59.1 R70.2 U1.18(AFE0_AD7)
THERM4: C60.1 R71.2 U1.19(AFE0_AD6)
THERMIN0: P13.1 R8.1 R67.1
THERMIN1: P9.1 R61.1 R66.1
THERMIN2: P10.1 R62.1 R65.1
THERMIN3: P11.1 R7.1 R70.1
THERMIN4: P12.1 R69.1 R71.1
URXD0: EXP3.3 U1.75(URXD0)
URXD1: EXP3.8 R102.2 U1.73(URXD1)
USB_PWR_MON: C82.1 R45.1 R46.2 U1.54(PC6)
USBVCC: F3.2 R3.2
UTXD0: EXP3.4 U1.66(UTXD0)
UTXD1: EXP3.2 R103.2 U1.114(UTXD1)
VMOT: C22.1 C23.1 C24.1 C25.1 C26.1 C27.1 D9.1(K) D10.1(K) U23.16(VMOT) U24.16(VMOT) U25.16(VMOT) U26.16(VMOT) U27.16(VMOT) U28.16(VMOT)
X-CS: H7.1 U1.78(PD16)
X-DIR: U1.98(PD11) U23.8(DIR)
X-EN: R38.1 U1.84(PD14) U23.1(EN)
X-MAX: U1.101(PD10) X+.1
X-MIN: U1.97(PC14) X-.1
X-SLP: H8.3 U23.6(SLP)
X-STEP: U1.121(PD6) U23.7(STEP)
Y-CS: H10.1 U1.128(PD3)
Y-DIR: U1.92(PD12) U24.8(DIR)
Y-EN: R39.1 U1.86(PC9) U24.1(EN)
Y-MAX: U1.100(PC16) Y+.1
Y-MIN: U1.93(PA2) Y-.1
Y-SLP: H9.3 U24.6(SLP)
Y-STEP: U1.119(PD7) U24.7(STEP)
Z-CS: H15.1 U1.106(PD15)
Z-DIR: U1.88(PD13) U25.8(DIR)
Z-EN: R40.1 U1.90(PC10) U25.1(EN)
Z-MAX: U1.4(PE0) Z+.1
Z-MIN: U1.108(PD29) Z-.1
Z-SLP: H16.3 U25.6(SLP)
Z-STEP: U1.113(PD8) U25.7(STEP)
Net-(C11-1): C11.1 D12.1(C) L1.1 U16.6(LX)
Net-(C11-2): C11.2 U16.1(BST)
Net-(C16-2): C16.2 U18.7(SS)
Net-(C17-2): C17.2 R35.1
Net-(C19-1): C19.1 D15.1(K) L2.1 U18.1(LX)
Net-(C19-2): C19.2 U18.2(BST)
Net-(C28-1): C28.1 U29.2(1D) U29.4(1PRE) U29.10(2PRE) U29.11(2CLK) U29.12(2D) U29.13(2CLR)
Net-(C29-1): C29.1 J22.CE
Net-(C35-2): C35.2 D25.1(K) S1.3 S1.4
Net-(C42-2): C42.2 L6.2(B) R56.1 U1.139(VDDPLL)
Net-(C43-2): C43.2 R56.2
Net-(C44-1): C44.1 U1.142(XIN) X2.3
Net-(C45-1): C45.1 U1.141(XOUT) X2.1
Net-(C83-1): C83.1 R103.1 U30.15(RXD0)
Net-(D2-2): D2.2(A) Q1.MB(D) U3.2
Net-(D3-2): D3.2(A) Q2.MB(D) U4.2
Net-(D4-1): D4.1(C) H3.2 U5.1
Net-(D4-2): D4.2(A) Q3.MB(D) U5.2
Net-(D5-2): D5.2(A) Q4.MB(D) U7.2
Net-(D6-1): D6.1(C) H1.2 P6.1 U8.1
Net-(D6-2): D6.2(A) P6.2 Q5.MB(D) U8.2
Net-(D7-1): D7.1(C) H2.2 P7.1 U9.1
Net-(D7-2): D7.2(A) P7.2 Q6.MB(D) U9.2
Net-(D14-2): D14.2(A) F3.1
Net-(D17-2): D17.2(K) R60.1
Net-(E0_MOT_A-1): E0_MOT_A.1 U26.14(2B)
Net-(E0_MOT_A-2): E0_MOT_A.2 U26.13(2A)
Net-(E0_MOT_A-3): E0_MOT_A.3 U26.12(1A)
Net-(E0_MOT_A-4): E0_MOT_A.4 U26.11(1B)
Net-(E1_MOT_A-1): E1_MOT_A.1 U27.14(2B)
Net-(E1_MOT_A-2): E1_MOT_A.2 U27.13(2A)
Net-(E1_MOT_A-3): E1_MOT_A.3 U27.12(1A)
Net-(E1_MOT_A-4): E1_MOT_A.4 U27.11(1B)
Net-(E2_MOT_A-1): E2_MOT_A.1 U28.14(2B)
Net-(E2_MOT_A-2): E2_MOT_A.2 U28.13(2A)
Net-(E2_MOT_A-3): E2_MOT_A.3 U28.12(1A)
Net-(E2_MOT_A-4): E2_MOT_A.4 U28.11(1B)
Net-(F1-1): F1.1 U10.2
Net-(F2-1): F2.1 U15.2
Net-(H5-2): H5.2 R13.2 U23.2(MS1)
Net-(H6-2): H6.2 U23.3(MS2)
Net-(H7-2): H7.2 U23.4(MS3)
Net-(H8-2): H8.2 U23.5(RST)
Net-(H9-2): H9.2 U24.5(RST)
Net-(H10-2): H10.2 U24.4(MS3)
Net-(H11-2): H11.2 U24.3(MS2)
Net-(H12-2): H12.2 R51.2 U24.2(MS1)
Net-(H13-2): H13.2 R72.2 U25.2(MS1)
Net-(H14-2): H14.2 U25.3(MS2)
Net-(H15-2): H15.2 U25.4(MS3)
Net-(H16-2): H16.2 U25.5(RST)
Net-(H17-2): H17.2 R80.2 U26.2(MS1)
Net-(H18-2): H18.2 U26.3(MS2)
Net-(H19-2): H19.2 U26.4(MS3)
Net-(H20-2): H20.2 U26.5(RST)
Net-(H21-2): H21.2 R81.2 U27.2(MS1)
Net-(H22-2): H22.2 U27.3(MS2)
Net-(H23-2): H23.2 U27.4(MS3)
Net-(H24-2): H24.2 U27.5(RST)
Net-(H25-2): H25.2 R84.2 U28.2(MS1)
Net-(H26-2): H26.2 U28.3(MS2)
Net-(H27-2): H27.2 U28.4(MS3)
Net-(H28-2): H28.2 U28.5(RST)
Net-(J15-1): J15.1(DAT2) R48.1 R73.1
Net-(J15-2): J15.2(DAT3) R49.1 R74.1
Net-(J15-3): J15.3(CMD) R50.1 R63.1
Net-(J15-5): J15.5(CLK) R68.1
Net-(J15-7): J15.7(DAT0/DO) R75.1 R77.1
Net-(J15-8): J15.8(DAT1) R76.1 R78.1
Net-(J15-9): J15.9(Card_Detect) R64.1 R79.1
Net-(J22-2): J22.2(DN) R55.1
Net-(J22-3): J22.3(DP) R54.1
Net-(L7-2): L7.2(B) U30.8(VCC)
Net-(LED1-2): LED1.2(-) R1.2
Net-(LED2-1): LED2.1(+) R2.1
Net-(LED3-1): LED3.1(+) R3.1
Net-(LED4-2): LED4.2(-) R4.2
Net-(LED5-2): LED5.2(-) R5.2
Net-(LED6-1): LED6.1(+) R6.1
Net-(LED7-1): LED7.1(+) R14.1
Net-(LED8-1): LED8.1(+) R19.1
Net-(LED9-1): LED9.1(+) R22.1
Net-(LED10-1): LED10.1(+) R25.2
Net-(LED11-1): LED11.1(+) R26.1
Net-(LED12-1): LED12.1(+) R31.1
Net-(Q1-4): Q1.4(G) R15.1
Net-(Q2-4): Q2.4(G) R18.1
Net-(Q3-4): Q3.4(G) R21.1
Net-(Q4-4): Q4.4(G) U6.5(VCC)
Net-(Q5-4): Q5.4(G) R27.1
Net-(Q6-4): Q6.4(G) R30.1
Net-(R9-2): R9.2 U1.91(TWD0)
Net-(R10-2): R10.2 U1.77(TWCK0)
Net-(R23-1): R23.1 U6.2(A)
Net-(R34-2): R34.2 U18.4(FSW)
Net-(R35-2): R35.2 U18.5(COMP)
Net-(R44-1): R44.1 R53.1 U30.1(REST)
Net-(R47-1): R47.1 U30.12(GPIO0)
Net-(R82-2): R82.2 U29.5(1Q) U30.13(GPIO4)
Net-(R99-1): R99.1 U30.10(GPIO15)
Net-(R100-1): R100.1 U30.5(GPIO14)
Net-(R101-1): R101.1 U30.6(GPIO12)
Net-(R102-1): R102.1 U30.16(TXD0)
Net-(R105-1): R105.1 U30.7(GPIO13)
Net-(U23-11): U23.11(1B) X_MOT_A.4
Net-(U23-12): U23.12(1A) X_MOT_A.3
Net-(U23-13): U23.13(2A) X_MOT_A.2
Net-(U23-14): U23.14(2B) X_MOT_A.1
Net-(U24-11): U24.11(1B) Y_MOT_A.4
Net-(U24-12): U24.12(1A) Y_MOT_A.3
Net-(U24-13): U24.13(2A) Y_MOT_A.2
Net-(U24-14): U24.14(2B) Y_MOT_A.1
Net-(U25-11): U25.11(1B) Z_MOT_A.4
Net-(U25-12): U25.12(1A) Z_MOT_A.3
Net-(U25-13): U25.13(2A) Z_MOT_A.2
Net-(U25-14): U25.14(2B) Z_MOT_A.1

Not connected (* = marked no-connect by the designer): J21 7(NC/RTCK)*; J22 4(ID)*; U1 1(PD0) 6(PE1) 7(PE2) 10(PE3) 11(AFE0_AD14) 12(AFE0_AD13) 13(TIOA4) 14(AFE0_AD11) 24(AFE0_AD1) 25(PA17/AFE0_AD0) 31(PB3/AFE1_AD1) 35(PA7/XIN32) 36(PA8/XOUT32) 38(AFE1_AD4) 39(PC2) 41(PC4/AFE1_AD7) 56(RTS1) 74(PD17) 82(TIOA7) 94(TIOA8) 102(TIOA0) 127(TIOA4) 140(DAC1); U6 4(Y); U17 4(NC)*; U29 6(1Q)* 8(2Q)* 9(2Q)*; U30 2(ADC) 4(GPIO16) 11(GPIO2) 14(GPIO5)

## Notes on the sheets
sheet 2
- ADVREF requires a filter
- To ensure stability, an external 2.2 μF output capacitor, CDOUT must be
   connected between the VDDOUT and the closest GND pin of the device.
  The ESR (Equivalent Series Resistance) of the capacitor must be in the range
  0.1Ω to 10Ω. Solid tantalum and multilayer ceramic capacitors are all
  suitable as output capacitor. A 100 nF bypass capacitor between VDDOUT
  and the closest GND pin of the device helps decrease output noise and
  improves the load transient response.
- VDDPLL
- A 4.7 μF or higher ceramic capacitor must be
  connected between VDDIN and the closest
  GND pin of the device.
  This large decoupling capacitor is mandatory
  to reduce startup current,  improving transient
  response and noise rejection.
- VDDIN
- VDDIO
- The ESR  of C68 must be in the range 0.1Ω to 10Ω.
- VDDCORE
- VSSA sensing
- Do Not Populate the JTAG header or resistors R36,R49,R52
- Fuse to protect the SAM from
  VIN applied to VSSA in error.
  Multicomp MC36207, Bel Fuse 0ZCJ0020FF2E
sheet 7
- All thermistors should be pulled up to ADVREF
sheet 13
- 5V 1.2A Buck Regulator
- 3.3V 600mA LDO Regulator
- 12V 4A Buck Regulator
sheet 14
- WIFI
- USB
- DNP ( R82 is populated instead of the 74HC74
  As a bypass. Either populate R82 or U12 not Both)
- uSD
